# Altium project Underwater_Robot_Controller.PrjPcb (part 1 of 2)
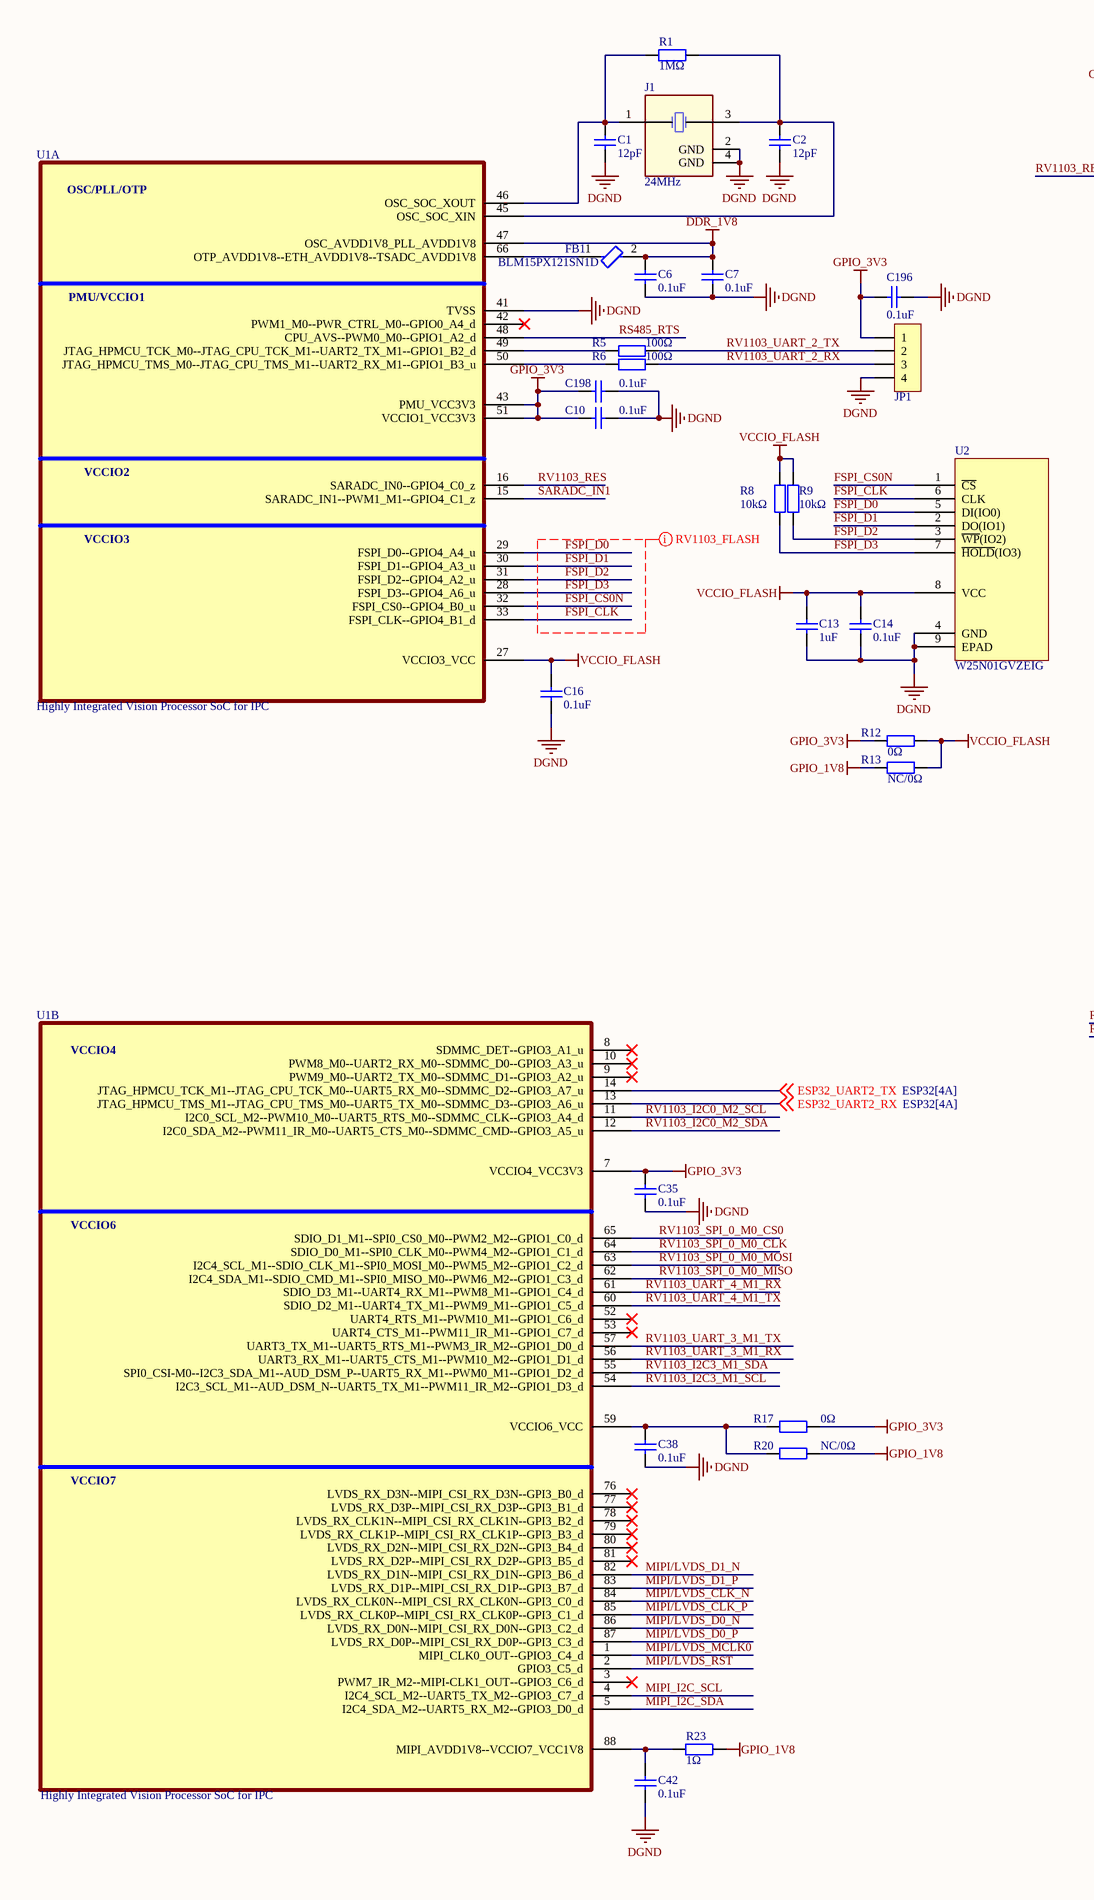
[diagram p0: RV1103.SchDoc, left]
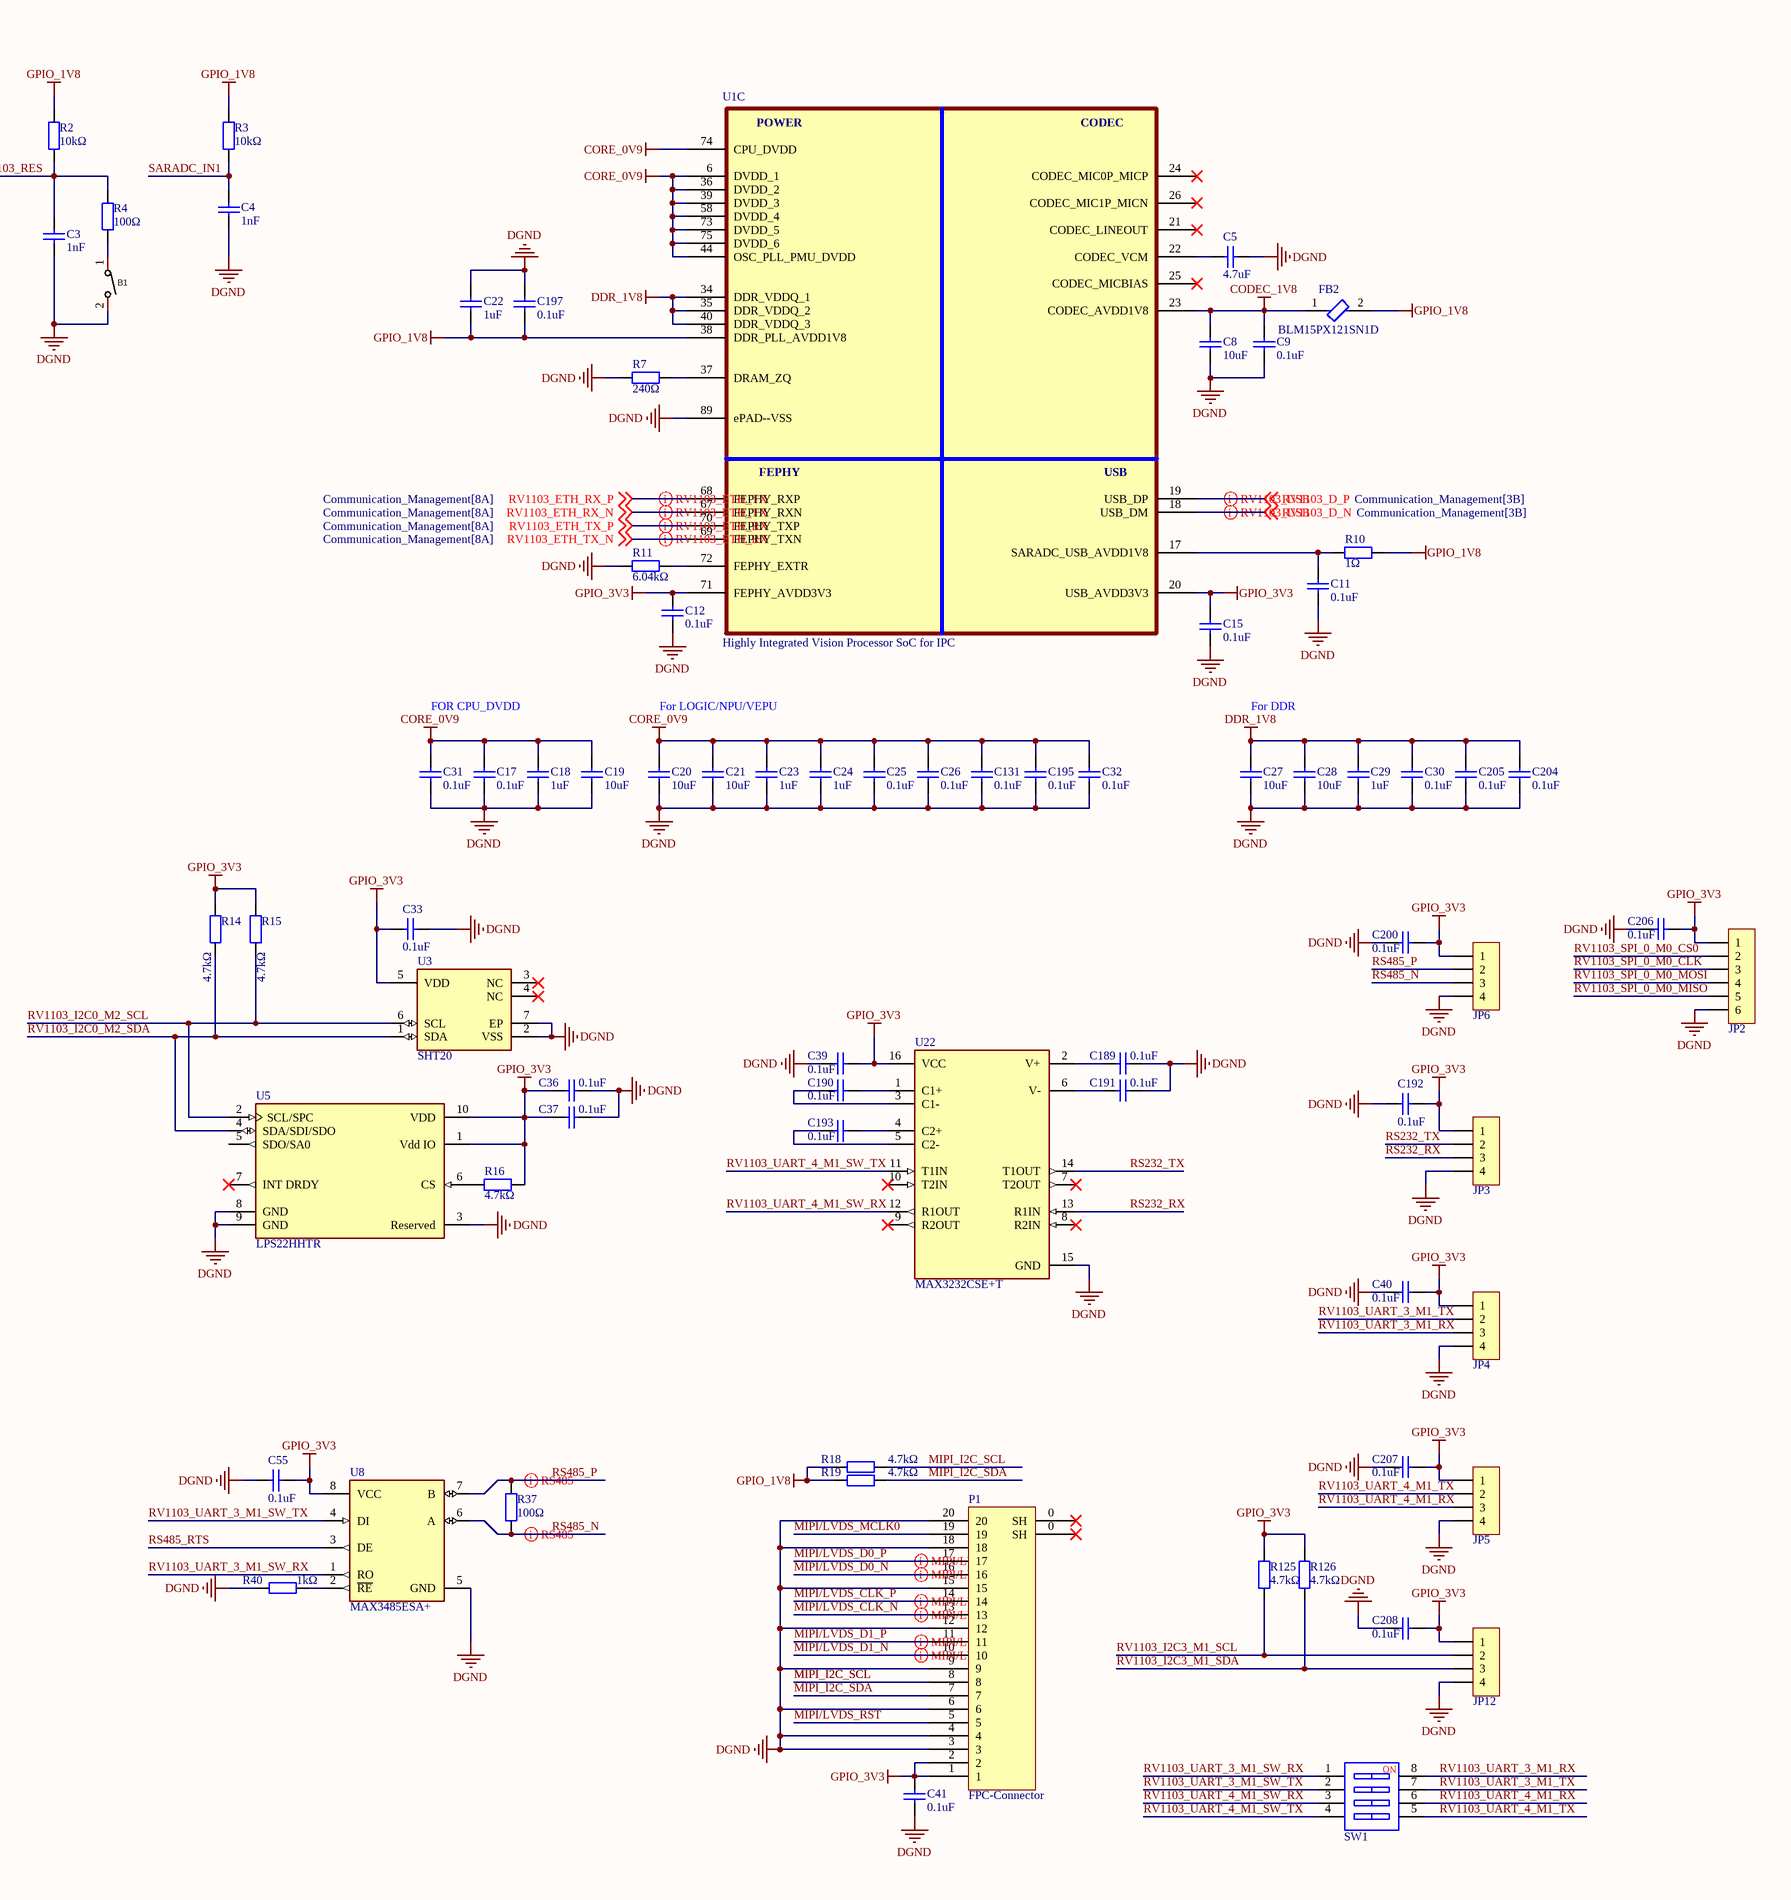
[diagram p1: RV1103.SchDoc, right]
4 sheets, 444 parts. Net scope: global (net labels, ports and power ports of the same name join across sheets).
Board file: URC.PcbDoc
Sheets:
  RV1103.SchDoc
  ESP32.SchDoc
  Power.SchDoc
  Communication_Management.SchDoc

## Sheet RV1103.SchDoc
size A2; Author: NZY(SFerret); SheetNumber: 1; SheetTotal: 4

### Parts
B1  Bottom-2P-1Way  [SW-SMD_L4.0-W2.9-LS5.0]  (value not drawn)
C1  12pF  [0402_C]
C2  12pF  [0402_C]
C3  1nF  [0402_C]
C4  1nF  [0402_C]
C5  4.7uF  [0402_C]
C6  0.1uF  [0402_C]
C7  0.1uF  [0402_C]
C8  10uF  [0402_C]
C9  0.1uF  [0402_C]
C10  0.1uF  [0402_C]
C11  0.1uF  [0402_C]
C12  0.1uF  [0402_C]
C13  1uF  [0603_C]
C14  0.1uF  [0603_C]
C15  0.1uF  [0402_C]
C16  0.1uF  [0402_C]
C17  0.1uF  [0402_C]
C18  1uF  [0402_C]
C19  10uF  [0603_C]
C20  10uF  [0603_C]
C21  10uF  [0603_C]
C22  1uF  [0402_C]
C23  1uF  [0402_C]
C24  1uF  [0402_C]
C25  0.1uF  [0402_C]
C26  0.1uF  [0402_C]
C27  10uF  [0603_C]
C28  10uF  [0603_C]
C29  1uF  [0402_C]
C30  0.1uF  [0402_C]
C31  0.1uF  [0402_C]
C32  0.1uF  [0402_C]
C33  0.1uF  [0603_C]
C35  0.1uF  [0402_C]
C36  0.1uF  [0603_C]
C37  0.1uF  [0603_C]
C38  0.1uF  [0402_C]
C39  0.1uF  [0603_C]
C40  0.1uF  [0603_C]
C41  0.1uF  [0603_C]
C42  0.1uF  [0402_C]
C55  0.1uF  [0603_C]
C131  0.1uF  [0402_C]
C189  0.1uF  [0603_C]
C190  0.1uF  [0603_C]
C191  0.1uF  [0603_C]
C192  0.1uF  [0603_C]
C193  0.1uF  [0603_C]
C195  0.1uF  [0402_C]
C196  0.1uF  [0603_C]
C197  0.1uF  [0402_C]
C198  0.1uF  [0402_C]
C200  0.1uF  [0603_C]
C204  0.1uF  [0402_C]
C205  0.1uF  [0402_C]
C206  0.1uF  [0603_C]
C207  0.1uF  [0603_C]
C208  0.1uF  [0603_C]
FB1  BLM15PX121SN1D  [FP-BLM15-0_05-d0_7-MFG]
FB2  BLM15PX121SN1D  [FP-BLM15-0_05-d0_7-MFG]
J1  24MHz  [SMD-2520_4P]
JP1  HDR-1X4  [MX 1.25-LS-4P]  (value not drawn)
JP2  HDR-1X6  [MX 1.25-LS-6P]  (value not drawn)
JP3  HDR-1X4  [MX 1.25-LS-4P]  (value not drawn)
JP4  HDR-1X4  [MX 1.25-LS-4P]  (value not drawn)
JP5  HDR-1X4  [MX 1.25-LS-4P]  (value not drawn)
JP6  HDR-1X4  [MX 1.25-LS-4P]  (value not drawn)
JP12  HDR-1X4  [MX 1.25-LS-4P]  (value not drawn)
P1  FPC-Connector  [FPC0.5 2H-WS-20P]
R1  1MΩ  [0402_R]
R2  10kΩ  [0402_R]
R3  10kΩ  [0402_R]
R4  100Ω  [0402_R]
R5  100Ω  [0402_R]
R6  100Ω  [0402_R]
R7  240Ω  [0402_R]
R8  10kΩ  [0603_R]
R9  10kΩ  [0603_R]
R10  1Ω  [0402_R]
R11  6.04kΩ  [0402_R]
R12  0Ω  [0402_R]
R13  NC/0Ω  [0402_R]
R14  4.7kΩ  [0603_R]
R15  4.7kΩ  [0603_R]
R16  4.7kΩ  [0603_R]
R17  0Ω  [0402_R]
R18  4.7kΩ  [0402_R]
R19  4.7kΩ  [0402_R]
R20  NC/0Ω  [0402_R]
R23  1Ω  [0402_R]
R37  100Ω  [0805_R]
R40  1kΩ  [0603_R]
R125  4.7kΩ  [0402_R]
R126  4.7kΩ  [0402_R]
SW1  SW-4P  [CSW1.27 SMD-4P]  (value not drawn)
U1  Highly Integrated Vision Processor SoC for IPC  [QFN35P900X900X95_HS-89N]  (parts A,B,C of 3)
U2  W25N01GVZEIG  [WSON-8_8X6_WIN]
U3  SHT20  [FP-SHT20-MFG]
U5  LPS22HHTR  [FP-HLGA-10L-DM00386636-MFG]
U8  MAX3485ESA+  [FP-S8-5-MFG]
U22  MAX3232CSE+T  [FP-S16-1-MFG]

### Nets
CODEC_1V8: C8.2 C9.2 FB2.1 U1.23(CODEC_AVDD1V8)
CORE_0V9: C17.2 C18.2 C19.2 C20.2 C21.2 C23.2 C24.2 C25.2 C26.2 C31.2 C32.2 C131.2 C195.2 U1.6(DVDD_1) U1.36(DVDD_2) U1.39(DVDD_3) U1.44(OSC_PLL_PMU_DVDD) U1.58(DVDD_4) U1.73(DVDD_5) U1.74(CPU_DVDD) U1.75(DVDD_6)
DDR_1V8: C6.1 C7.1 C27.2 C28.2 C29.2 C30.2 C204.2 C205.2 FB1.2 U1.34(DDR_VDDQ_1) U1.35(DDR_VDDQ_2) U1.40(DDR_VDDQ_3) U1.47(OSC_AVDD1V8_PLL_AVDD1V8)
DGND: B1.2 C1.1 C2.1 C3.1 C4.1 C5.2 C6.2 C7.2 C8.1 C9.1 C10.1 C11.1 C12.1 C13.1 C14.1 C15.1 C16.1 C17.1 C18.1 C19.1 C20.1 C21.1 C22.2 C23.1 C24.1 C25.1 C26.1 C27.1 C28.1 C29.1 C30.1 C31.1 C32.1 C33.2 C35.1 C36.2 C37.2 C38.1 C39.2 C40.2 C41.1 C42.1 C55.1 C131.1 C189.2 C191.2 C192.2 C195.1 C196.2 C197.2 C198.1 C200.1 C204.1 C205.1 C206.1 C207.2 C208.2 J1.2(GND) J1.4(GND) JP1.4 JP2.6 JP3.4 JP4.4 JP5.4 JP6.4 JP12.4 P1.3 P1.4 P1.6 P1.9 P1.12 P1.15 P1.18 P1.20 R7.1 R11.1 R40.2 U1.41(TVSS) U1.89(ePAD--VSS) U2.4(GND) U2.9(EPAD) U3.2(VSS) U3.7(EP) U5.3(Reserved) U5.8(GND) U5.9(GND) U8.5(GND) U22.15(GND)
GPIO_1V8: C22.1 C197.1 FB2.2 R2.2 R3.2 R10.2 R13.1 R18.2 R19.2 R20.2 R23.2 U1.38(DDR_PLL_AVDD1V8)
GPIO_3V3: C10.2 C12.2 C15.2 C33.1 C35.2 C36.1 C37.1 C39.1 C40.1 C41.2 C55.2 C192.1 C196.1 C198.2 C200.2 C206.2 C207.1 C208.1 JP1.1 JP2.1 JP3.1 JP4.1 JP5.1 JP6.1 JP12.1 P1.1 P1.2 R12.1 R14.2 R15.2 R16.1 R17.2 R125.2 R126.2 U1.7(VCCIO4_VCC3V3) U1.20(USB_AVDD3V3) U1.43(PMU_VCC3V3) U1.51(VCCIO1_VCC3V3) U1.71(FEPHY_AVDD3V3) U3.5(VDD) U5.1(Vdd_IO) U5.10(VDD) U8.8(VCC) U22.16(VCC)
VCCIO_FLASH: C13.2 C14.2 C16.2 R8.2 R9.2 R12.2 R13.2 U1.27(VCCIO3_VCC) U2.8(VCC)
ESP32_UART2_RX: U1.13(JTAG_HPMCU_TMS_M1--JTAG_CPU_TMS_M0--UART5_TX_M0--SDMMC_D3--GPIO3_A6_u) ; off-sheet ESP32_UART2_RX
ESP32_UART2_TX: U1.14(JTAG_HPMCU_TCK_M1--JTAG_CPU_TCK_M0--UART5_RX_M0--SDMMC_D2--GPIO3_A7_u) ; off-sheet ESP32_UART2_TX
FSPI_CLK: U1.33(FSPI_CLK--GPIO4_B1_d) U2.6(CLK)
FSPI_CS0N: U1.32(FSPI_CS0--GPIO4_B0_u) U2.1(~{CS})
FSPI_D0: U1.29(FSPI_D0--GPIO4_A4_u) U2.5(DI(IO0))
FSPI_D1: U1.30(FSPI_D1--GPIO4_A3_u) U2.2(DO(IO1))
FSPI_D2: R9.1 U1.31(FSPI_D2--GPIO4_A2_u) U2.3(~{WP}(IO2))
FSPI_D3: R8.1 U1.28(FSPI_D3--GPIO4_A6_u) U2.7(~{HOLD}(IO3))
MIPI/LVDS_CLK_N: P1.13 U1.84(LVDS_RX_CLK0N--MIPI_CSI_RX_CLK0N--GPI3_C0_d)
MIPI/LVDS_CLK_P: P1.14 U1.85(LVDS_RX_CLK0P--MIPI_CSI_RX_CLK0P--GPI3_C1_d)
MIPI/LVDS_D0_N: P1.16 U1.86(LVDS_RX_D0N--MIPI_CSI_RX_D0N--GPI3_C2_d)
MIPI/LVDS_D0_P: P1.17 U1.87(LVDS_RX_D0P--MIPI_CSI_RX_D0P--GPI3_C3_d)
MIPI/LVDS_D1_N: P1.10 U1.82(LVDS_RX_D1N--MIPI_CSI_RX_D1N--GPI3_B6_d)
MIPI/LVDS_D1_P: P1.11 U1.83(LVDS_RX_D1P--MIPI_CSI_RX_D1P--GPI3_B7_d)
MIPI/LVDS_MCLK0: P1.19 U1.1(MIPI_CLK0_OUT--GPIO3_C4_d)
MIPI/LVDS_RST: P1.5 U1.2(GPIO3_C5_d)
MIPI_I2C_SCL: P1.8 R18.1 U1.4(I2C4_SCL_M2--UART5_TX_M2--GPIO3_C7_d)
MIPI_I2C_SDA: P1.7 R19.1 U1.5(I2C4_SDA_M2--UART5_RX_M2--GPIO3_D0_d)
RS232_RX: JP3.3 U22.13(R1IN)
RS232_TX: JP3.2 U22.14(T1OUT)
RS485_N: JP6.3 R37.1 U8.6(A)
RS485_P: JP6.2 R37.2 U8.7(B)
RS485_RTS: U1.48(CPU_AVS--PWM0_M0--GPIO1_A2_d) U8.3(DE)
RV1103_D_N: U1.18(USB_DM) ; off-sheet RV1103_D_N
RV1103_D_P: U1.19(USB_DP) ; off-sheet RV1103_D_P
RV1103_ETH_RX_N: U1.67(FEPHY_RXN) ; off-sheet RV1103_ETH_RX_N
RV1103_ETH_RX_P: U1.68(FEPHY_RXP) ; off-sheet RV1103_ETH_RX_P
RV1103_ETH_TX_N: U1.69(FEPHY_TXN) ; off-sheet RV1103_ETH_TX_N
RV1103_ETH_TX_P: U1.70(FEPHY_TXP) ; off-sheet RV1103_ETH_TX_P
RV1103_I2C0_M2_SCL: R15.1 U1.11(I2C0_SCL_M2--PWM10_M0--UART5_RTS_M0--SDMMC_CLK--GPIO3_A4_d) U3.6(SCL) U5.2(SCL/SPC)
RV1103_I2C0_M2_SDA: R14.1 U1.12(I2C0_SDA_M2--PWM11_IR_M0--UART5_CTS_M0--SDMMC_CMD--GPIO3_A5_u) U3.1(SDA) U5.4(SDA/SDI/SDO)
RV1103_I2C3_M1_SCL: JP12.2 R125.1 U1.54(I2C3_SCL_M1--AUD_DSM_N--UART5_TX_M1--PWM11_IR_M2--GPIO1_D3_d)
RV1103_I2C3_M1_SDA: JP12.3 R126.1 U1.55(SPI0_CSI-M0--I2C3_SDA_M1--AUD_DSM_P--UART5_RX_M1--PWM0_M1--GPIO1_D2_d)
RV1103_RES: C3.2 R2.1 R4.2 U1.16(SARADC_IN0--GPIO4_C0_z)
RV1103_SPI_0_M0_CLK: JP2.3 U1.64(SDIO_D0_M1--SPI0_CLK_M0--PWM4_M2--GPIO1_C1_d)
RV1103_SPI_0_M0_CS0: JP2.2 U1.65(SDIO_D1_M1--SPI0_CS0_M0--PWM2_M2--GPIO1_C0_d)
RV1103_SPI_0_M0_MISO: JP2.5 U1.62(I2C4_SDA_M1--SDIO_CMD_M1--SPI0_MISO_M0--PWM6_M2--GPIO1_C3_d)
RV1103_SPI_0_M0_MOSI: JP2.4 U1.63(I2C4_SCL_M1--SDIO_CLK_M1--SPI0_MOSI_M0--PWM5_M2--GPIO1_C2_d)
RV1103_UART_2_RX: JP1.3 R6.2
RV1103_UART_2_TX: JP1.2 R5.2
RV1103_UART_3_M1_RX: JP4.3 SW1.8 U1.56(UART3_RX_M1--UART5_CTS_M1--PWM10_M2--GPIO1_D1_d)
RV1103_UART_3_M1_SW_RX: SW1.1 U8.1(RO)
RV1103_UART_3_M1_SW_TX: SW1.2 U8.4(DI)
RV1103_UART_3_M1_TX: JP4.2 SW1.7 U1.57(UART3_TX_M1--UART5_RTS_M1--PWM3_IR_M2--GPIO1_D0_d)
RV1103_UART_4_M1_RX: JP5.3 SW1.6 U1.61(SDIO_D3_M1--UART4_RX_M1--PWM8_M1--GPIO1_C4_d)
RV1103_UART_4_M1_SW_RX: SW1.3 U22.12(R1OUT)
RV1103_UART_4_M1_SW_TX: SW1.4 U22.11(T1IN)
RV1103_UART_4_M1_TX: JP5.2 SW1.5 U1.60(SDIO_D2_M1--UART4_TX_M1--PWM9_M1--GPIO1_C5_d)
SARADC_IN1: C4.2 R3.1 U1.15(SARADC_IN1--PWM1_M1--GPIO4_C1_z)
NetB1_1: B1.1 R4.1
NetC1_2: C1.2 J1.1(OSC1) R1.1 U1.46(OSC_SOC_XOUT)
NetC2_2: C2.2 J1.3(OSC2) R1.2 U1.45(OSC_SOC_XIN)
NetC5_1: C5.1 U1.22(CODEC_VCM)
NetC11_2: C11.2 R10.1 U1.17(SARADC_USB_AVDD1V8)
NetC38_2: C38.2 R17.1 R20.1 U1.59(VCCIO6_VCC)
NetC42_2: C42.2 R23.1 U1.88(MIPI_AVDD1V8--VCCIO7_VCC1V8)
NetC189_1: C189.1 U22.2(V+)
NetC190_1: C190.1 U22.3(C1-)
NetC190_2: C190.2 U22.1(C1+)
NetC191_1: C191.1 U22.6(V-)
NetC193_1: C193.1 U22.5(C2-)
NetC193_2: C193.2 U22.4(C2+)
NetFB1_1: FB1.1 U1.66(OTP_AVDD1V8--ETH_AVDD1V8--TSADC_AVDD1V8)
NetR5_1: R5.1 U1.49(JTAG_HPMCU_TCK_M0--JTAG_CPU_TCK_M1--UART2_TX_M1--GPIO1_B2_d)
NetR6_1: R6.1 U1.50(JTAG_HPMCU_TMS_M0--JTAG_CPU_TMS_M1--UART2_RX_M1--GPIO1_B3_u)
NetR7_2: R7.2 U1.37(DRAM_ZQ)
NetR11_2: R11.2 U1.72(FEPHY_EXTR)
NetR16_2: R16.2 U5.6(CS)
NetR40_1: R40.1 U8.2(~{RE})

Not connected (* = marked no-connect by the designer): P1 0(SH)*; U1 3(PWM7_IR_M2--MIPI-CLK1_OUT--GPIO3_C6_d)* 8(SDMMC_DET--GPIO3_A1_u)* 9(PWM9_M0--UART2_TX_M0--SDMMC_D1--GPIO3_A2_u)* 10(PWM8_M0--UART2_RX_M0--SDMMC_D0--GPIO3_A3_u)* 21(CODEC_LINEOUT)* 24(CODEC_MIC0P_MICP)* 25(CODEC_MICBIAS)* 26(CODEC_MIC1P_MICN)* 42(PWM1_M0--PWR_CTRL_M0--GPIO0_A4_d)* 52(UART4_RTS_M1--PWM10_M1--GPIO1_C6_d)* 53(UART4_CTS_M1--PWM11_IR_M1--GPIO1_C7_d)* 76(LVDS_RX_D3N--MIPI_CSI_RX_D3N--GPI3_B0_d)* 77(LVDS_RX_D3P--MIPI_CSI_RX_D3P--GPI3_B1_d)* 78(LVDS_RX_CLK1N--MIPI_CSI_RX_CLK1N--GPI3_B2_d)* 79(LVDS_RX_CLK1P--MIPI_CSI_RX_CLK1P--GPI3_B3_d)* 80(LVDS_RX_D2N--MIPI_CSI_RX_D2N--GPI3_B4_d)* 81(LVDS_RX_D2P--MIPI_CSI_RX_D2P--GPI3_B5_d)*; U3 3(NC)* 4(NC)*; U5 5(SDO/SA0) 7(INT_DRDY)*; U22 7(T2OUT)* 8(R2IN)* 9(R2OUT)* 10(T2IN)*

### Layout directives
differential pair: MIPI/LVDS_CLK_N, MIPI/LVDS_CLK_P, MIPI/LVDS_D0_N, MIPI/LVDS_D0_P, MIPI/LVDS_D1_N, MIPI/LVDS_D1_P, RS485_N, RS485_P, RV1103_D_N, RV1103_D_P, RV1103_ETH_RX_N, RV1103_ETH_RX_P, RV1103_ETH_TX_N, RV1103_ETH_TX_P
net class RV1103_FLASH: FSPI_CLK, FSPI_CS0N, FSPI_D0, FSPI_D1, FSPI_D2, FSPI_D3

### Notes on the sheet
- FOR CPU_DVDD
- For LOGIC/NPU/VEPU
- For DDR
- (in symbol RV1103G, part A) OSC/PLL/OTP; PMU/VCCIO1; VCCIO2; VCCIO3
- (in symbol RV1103G, part B) VCCIO4; VCCIO6; VCCIO7
- (in symbol RV1103G, part C) POWER; CODEC; FEPHY; USB
- (in symbol SW-4P) NO

### Library data of the parts
B1 = Bottom-2P-1Way: 轻触按键; Manufacturer: SHOU HAN(首韩); Symbol: TS342A2P-WZ; Add into BOM: yes; Device: TS342A2P-WZ; LCSC Part Name: 轻触开关 3*4*2 两脚小龟不带柱 250gf 黑色塑胶按钮; Supplier Part: C557591; Manufacturer Part: TS342A2P-WZ; Supplier Footprint: SMD; JLCPCB Part Class: Extended Part; Datasheet: https://atta.szlcsc.com/upload/public/pdf/source/20200519/C557591_B3A5A21584733303F06306F18577DA8B.pdf; Supplier: LCSC; Convert to PCB: yes
C1-C33 C35-C42 C55 C131 C189-C193 C195-C198 C200 C204-C208 = SMT_Cap: 贴片电容; ComponentLink1Description: 供应商链接; ComponentLink1URL: http://www.szlcsc.com/product/details_29010.html; Package: 0805; Supplier: LC; SuppliersPartNumber: C28260
FB1 FB2 = CMP-0686-00133-3: Chip Ferrite Bead, 0402, 120Ω @ 100MHz, 0.055Ω, 25%, 2A; Impedance: 120R; DC Resistance (DCR): 55mR; Number of Circuits: 1; Material: Steel; Lead Free: Lead Free; Package Quantity: 10000; Width: 0.5mm; Case Code (Metric): 1005; Test Frequency: 100MHz; Weight: 2.3E-05oz; Max DC Current: 2A; Current Rating: 2A; REACH SVHC: No SVHC; Case Code (Imperial): 0402; Min Operating Temperature: -55°C; Max Operating Temperature: 125°C; Max Current Rating: 2A; Series: EMIFIL®, BLM15P; Tolerance: 25%; Termination: SMD/SMT; Number of Lines: 1; Case/Package: 0402; RoHS Compliant: Yes; Number of Pins: 2; Length: 1mm; Height: 0.5mm; Packaging: Tape and Reel
J1 = Oscillator_SMT_4P
JP1 JP3-JP6 JP12 = Header 4: 4P接插件; 卖家免费技术支持，联系售后: 唯一出售店铺网址https://shop463601444.taobao.com; 封装库来自淘宝卖家 ID：黄晶宝石: 其他店铺购入均为假冒，请申请退款，本店现金奖励; 优秀评价可免费更新封装库: 联系淘宝ID：黄晶宝石，获取更新版封装库; BOM名称: 4P接插件
JP2 = Header 6: 6P接插件; 卖家免费技术支持，联系售后: 唯一出售店铺网址https://shop463601444.taobao.com; 封装库来自淘宝卖家 ID：黄晶宝石: 其他店铺购入均为假冒，请申请退款，本店现金奖励; 优秀评价可免费更新封装库: 联系淘宝ID：黄晶宝石，获取更新版封装库; BOM名称: 6P接插件
P1 = FFC/FPC-0.5-WS-20
R1-R20 R23 R37 R40 R125 R126 = SMT_Res: 贴片电阻; ComponentLink1Description: 供应商链接; ComponentLink1URL: http://www.szlcsc.com/product/details_23980.html; Package: 0603; Supplier: LC; SuppliersPartNumber: C23253
SW1 = SW-4P: 4路编码开关; 免费技术支持，联系售后: 唯一出售店铺网址https://shop463601444.taobao.com; 封装库来自淘宝卖家 ID：黄晶宝石: 其他店铺购入均为盗版假冒封装库，请立即申请退款，本店3~10元现金奖励; BOM名称: 4路编码开关
U1 = RV1103G: RV1103 is a highly integrated vision processor SoC for IPC, especially for AI related / applications.
U2 = W25N01GVZEIG: 1G-BIT SPI FLASH
U3 = CMP-2000-05344-2: SENSOR HUMID/TEMP 3V I2C 3% SMD; Manufacturer: Sensirion; Min Supply Voltage: 2.1V; Automotive Grade: Grade 1; Max Supply Voltage: 3.6V; Operating Supply Current: 300uA; Resolution: 14bits; Device Class L2: Temperature and Humidity Sensors; Ipc Land Pattern Name: DFN300X300X110-6; Category: IC; Device Class L3: unset; Accuracy: 3%; ComponentLink2URL: https://www.sensirion.com/fileadmin/user_upload/customers/sensirion/Dokumente/0_Datasheets/Humidity/Sensirion_Humidity_Sensors_SHT20_Datasheet.pdf; Temperature: -40°C to +125°C; Interface: I2C; Lead Free: Yes; Temperature Range High: +125°C; Automotive: Yes; Device Class L1: Sensors; Height: 1.1mm; Temperature Range Low: -40°C; ComponentLink2Description: Datasheet; Octopart: https://octopart.com/sht20-sensirion-47077745; Sensor Output: I2C; Manufacturer Part Number: SHT20; Package: 0; Digikey Description: SENSOR HUMID/TEMP 3V I2C 3% SMD; RoHS: TRUE
U5 = CMP-12182-000001-1: CONSUMER MEMS; Manufacturer: STMicroelectronics; Operating Supply Current: 4-12uA; Sensor Output: I2C,SPI; Port Style: No Port; Min Supply Voltage: 1.7V; Max Supply Voltage: 3.7V; Package: HLGA-10L-DM00386636; Temperature Range Low: -40°C; RoHS: TRUE; Device Class L1: Sensors; Automotive: No; Manufacturer Part Number: LPS22HHTR; ComponentLink2URL: https://www.st.com/resource/en/datasheet/lps22hh.pdf; Temperature: -40°C to +85°C; Category: IC; Device Class L3: unset; ComponentLink2Description: Datasheet; Lead Free: Yes; Temperature Range High: +85°C; Octopart: https://octopart.com/lps22hhtr-stmicroelectronics-94834025; Footprint Url: https://www.st.com/content/ccc/resource/technical/document/technical_note/73/17/9c/16/dd/96/4a/01/CD00134799.pdf/files/CD00134799.pdf/jcr:content/translations/en.CD00134799.pdf; Height: 0.8mm; Device Class L2: Pressure Sensors; Digikey Description: CONSUMER MEMS
U8 = CMP-05679-000020-1: IC TXRX RS485/422 10MBPS 8SOIC; Manufacturer: Maxim Integrated; Nominal Supply Current: 0.95-1.1mA; Data Rate: 10Mbits/s; Min Supply Voltage: 3V; Interface: RS-485,RS-422; Number Of Transmitters: 1; Max Supply Voltage: 3.6V; Max Junction Temp: +160°C; Standoff Height: 0.1mm; Simplex Duplex: Half Duplex; Height: 1.75mm; Temperature Range High: +85°C; Device Class L2: Interface ICs; Digikey Description: IC TXRX RS485/422 10MBPS 8SOIC; Temperature: -40°C to +85°C; Device Class L3: RS-232 / RS-422 / RS-485 Interface ICs; Temperature Range Low: -40°C; Footprint Url: https://pdfserv.maximintegrated.com/land_patterns/90-0096.PDF; Category: IC; ComponentLink2URL: https://datasheets.maximintegrated.com/en/ds/MAX3483-MAX3491.pdf; Package: S8-5; Octopart: https://octopart.com/max3485esa%2B-maxim+integrated-39731860; RoHS: TRUE; Manufacturer Part Number: MAX3485ESA+; Lead Free: Yes; ComponentLink2Description: Datasheet; Device Class L1: Integrated Circuits (ICs); Mouser Description: 3.3V Powered, 10Mbps and Slew-Rate Limited, True RS-485/RS-422 Transceivers; Number Of Receivers: 1; Automotive: No
U22 = CMP-2000-06662-2: IC TXRX RS-232 LP 16SOIC; Manufacturer: Maxim Integrated; Nominal Supply Current: 0.3mA; Max Supply Voltage: 5.5V; Number Of Transmitters: 2; Simplex Duplex: Full Duplex; Min Supply Voltage: 3V; Data Rate: 235kbits/s; Standoff Height: 0.1mm; ComponentLink2URL: https://www.maximintegrated.com/en/ds/MAX3222-MAX3241.pdf; Device Class L2: Interface ICs; Interface: RS-232; RoHS: TRUE; Octopart: https://octopart.com/max3232cse%2Bt-maxim+integrated-39731899; Category: IC; Device Class L3: RS-232 / RS-422 / RS-485 Interface ICs; Automotive: No; Mouser Description: RS-232 Interface IC 3-5.5V 235kbps Transceiver; Temperature Range High: +70°C; Manufacturer Part Number: MAX3232CSE+T; Number Of Receivers: 2; Digikey Description: IC TXRX RS-232 LP 16SOIC; ComponentLink2Description: Datasheet; Temperature Range Low: 0°C; Footprint Url: https://pdfserv.maximintegrated.com/land_patterns/90-0097.PDF; Device Class L1: Integrated Circuits (ICs); Ipc Land Pattern Name: SOIC127P600X155-16; Lead Free: Yes; Package: S16-1; Height: 1.75mm; Temperature: 0°C to +70°C

## Sheet ESP32.SchDoc
size A2; SheetNumber: 2; SheetTotal: 4
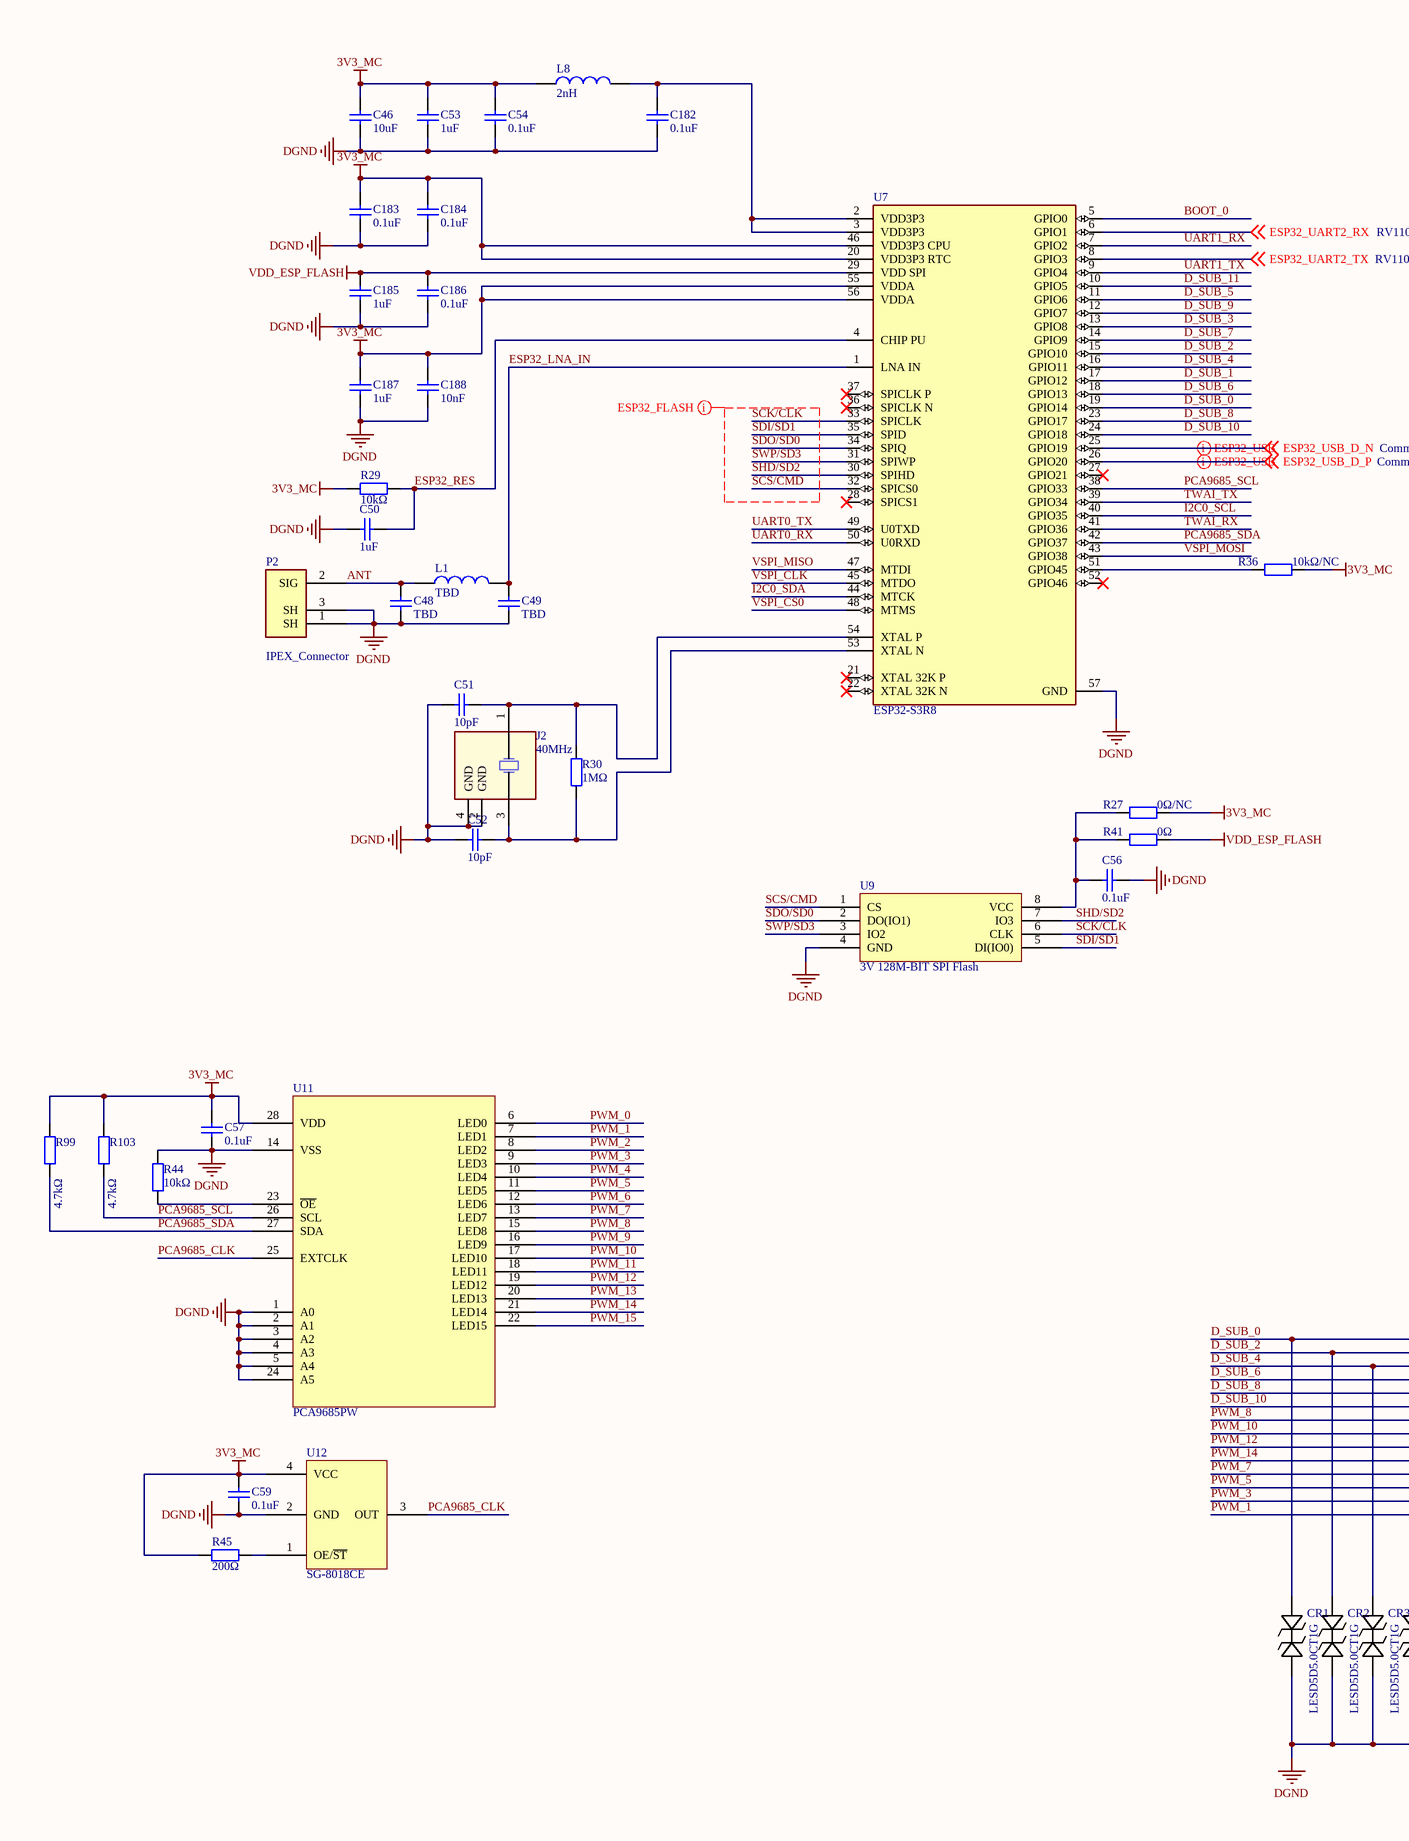
[diagram p2: ESP32.SchDoc, left]
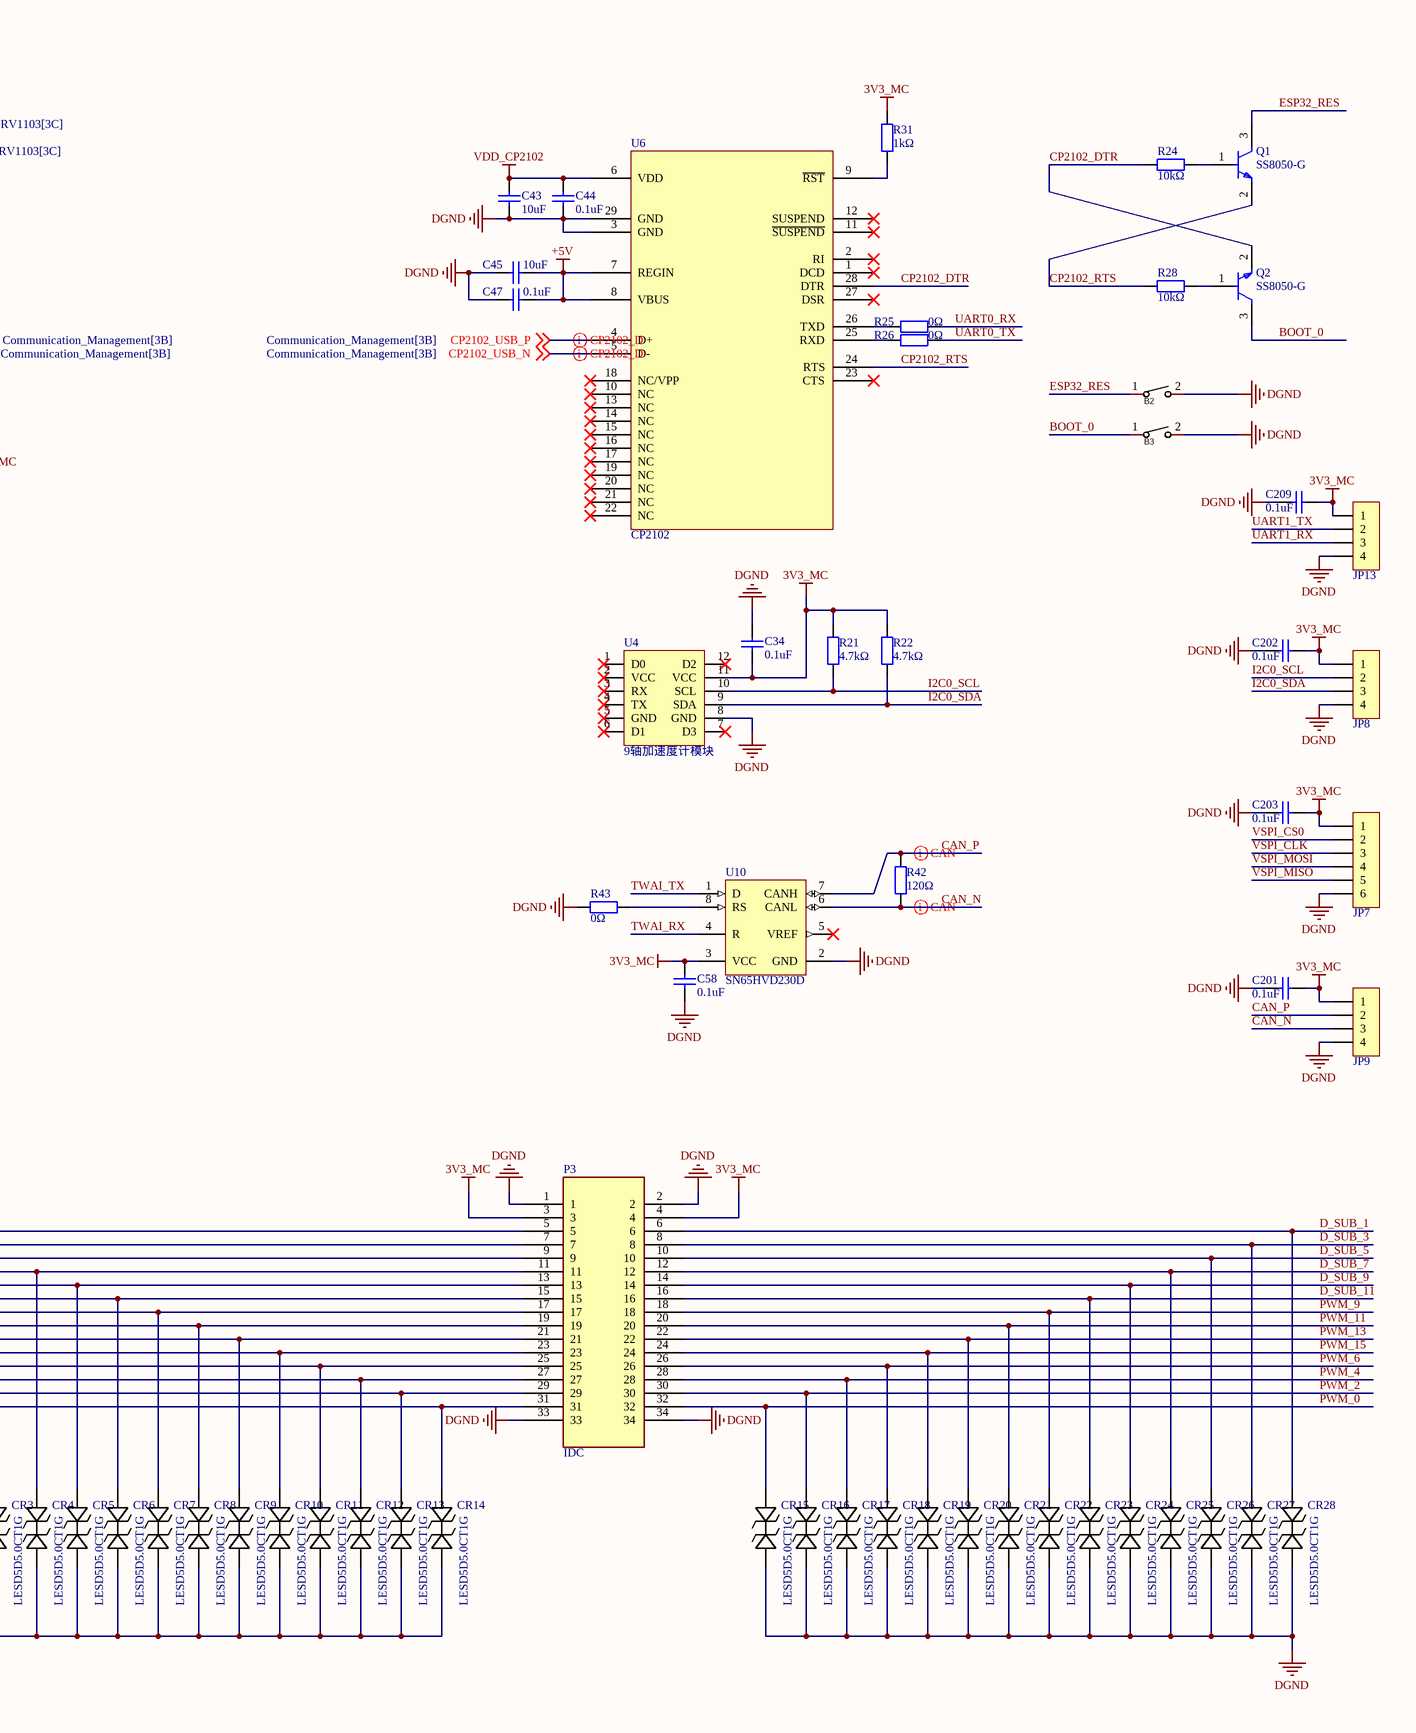
[diagram p3: ESP32.SchDoc, right]

### Parts
B2  Bottom-2P-1Way  [SW-SMD_L4.0-W2.9-LS5.0]  (value not drawn)
B3  Bottom-2P-1Way  [SW-SMD_L4.0-W2.9-LS5.0]  (value not drawn)
C34  0.1uF  [0603_C]
C43  10uF  [0603_C]
C44  0.1uF  [0603_C]
C45  10uF  [0603_C]
C46  10uF  [0603_C]
C47  0.1uF  [0603_C]
C48  TBD  [0402_C]
C49  TBD  [0402_C]
C50  1uF  [0402_C]
C51  10pF  [0402_C]
C52  10pF  [0402_C]
C53  1uF  [0603_C]
C54  0.1uF  [0402_C]
C56  0.1uF  [0603_C]
C57  0.1uF  [0603_C]
C58  0.1uF  [0603_C]
C59  0.1uF  [0603_C]
C182  0.1uF  [0402_C]
C183  0.1uF  [0402_C]
C184  0.1uF  [0402_C]
C185  1uF  [0402_C]
C186  0.1uF  [0402_C]
C187  1uF  [0402_C]
C188  10nF  [0402_C]
C201  0.1uF  [0603_C]
C202  0.1uF  [0603_C]
C203  0.1uF  [0603_C]
C209  0.1uF  [0603_C]
CR1  LESD5D5.0CT1G  [CR_5.0CT1G_UMW]
CR2  LESD5D5.0CT1G  [CR_5.0CT1G_UMW]
CR3  LESD5D5.0CT1G  [CR_5.0CT1G_UMW]
CR4  LESD5D5.0CT1G  [CR_5.0CT1G_UMW]
CR5  LESD5D5.0CT1G  [CR_5.0CT1G_UMW]
CR6  LESD5D5.0CT1G  [CR_5.0CT1G_UMW]
CR7  LESD5D5.0CT1G  [CR_5.0CT1G_UMW]
CR8  LESD5D5.0CT1G  [CR_5.0CT1G_UMW]
CR9  LESD5D5.0CT1G  [CR_5.0CT1G_UMW]
CR10  LESD5D5.0CT1G  [CR_5.0CT1G_UMW]
CR11  LESD5D5.0CT1G  [CR_5.0CT1G_UMW]
CR12  LESD5D5.0CT1G  [CR_5.0CT1G_UMW]
CR13  LESD5D5.0CT1G  [CR_5.0CT1G_UMW]
CR14  LESD5D5.0CT1G  [CR_5.0CT1G_UMW]
CR15  LESD5D5.0CT1G  [CR_5.0CT1G_UMW]
CR16  LESD5D5.0CT1G  [CR_5.0CT1G_UMW]
CR17  LESD5D5.0CT1G  [CR_5.0CT1G_UMW]
CR18  LESD5D5.0CT1G  [CR_5.0CT1G_UMW]
CR19  LESD5D5.0CT1G  [CR_5.0CT1G_UMW]
CR20  LESD5D5.0CT1G  [CR_5.0CT1G_UMW]
CR21  LESD5D5.0CT1G  [CR_5.0CT1G_UMW]
CR22  LESD5D5.0CT1G  [CR_5.0CT1G_UMW]
CR23  LESD5D5.0CT1G  [CR_5.0CT1G_UMW]
CR24  LESD5D5.0CT1G  [CR_5.0CT1G_UMW]
CR25  LESD5D5.0CT1G  [CR_5.0CT1G_UMW]
CR26  LESD5D5.0CT1G  [CR_5.0CT1G_UMW]
CR27  LESD5D5.0CT1G  [CR_5.0CT1G_UMW]
CR28  LESD5D5.0CT1G  [CR_5.0CT1G_UMW]
J2  40MHz  [SMD-2520_4P]
JP7  HDR-1X6  [MX 1.25-LS-6P]  (value not drawn)
JP8  HDR-1X4  [MX 1.25-LS-4P]  (value not drawn)
JP9  HDR-1X4  [MX 1.25-LS-4P]  (value not drawn)
JP13  HDR-1X4  [MX 1.25-LS-4P]  (value not drawn)
L1  TBD  [0402_L]
L8  2nH  [0402_L]
P2  IPEX_Connector  [IPEX]
P3  IDC  [IDC2.54-LI-2x17P]
Q1  SS8050-G  [FP-SS8050-G-MFG]
Q2  SS8050-G  [FP-SS8050-G-MFG]
R21  4.7kΩ  [0603_R]
R22  4.7kΩ  [0603_R]
R24  10kΩ  [0603_R]
R25  0Ω  [0603_R]
R26  0Ω  [0603_R]
R27  0Ω/NC  [0402_R]
R28  10kΩ  [0603_R]
R29  10kΩ  [0402_R]
R30  1MΩ  [0402_R]
R31  1kΩ  [0603_R]
R36  10kΩ/NC  [0402_R]
R41  0Ω  [0402_R]
R42  120Ω  [0805_R]
R43  0Ω  [0603_R]
R44  10kΩ  [0603_R]
R45  200Ω  [0603_R]
R99  4.7kΩ  [0603_R]
R103  4.7kΩ  [0603_R]
U4  9轴加速度计模块  [9轴加速度计]
U6  CP2102  [QFN50P500X500X100_HS-29N]
U7  ESP32-S3R8  [QFN40P700X700X90_HS-57M]
U9  3V 128M-BIT SPI Flash  [SOIC-8-Body 5.28x5.28mm]
U10  SN65HVD230D  [D0008A_M]
U11  PCA9685PW  [SOP65P640X110-28N]
U12  SG-8018CE  [OSC-2520-4P]

### Nets
3V3_MC: C34.1 C46.2 C53.2 C54.2 C57.2 C58.2 C59.2 C183.2 C184.2 C187.2 C188.2 C201.2 C202.2 C203.2 C209.2 JP7.1 JP8.1 JP9.1 JP13.1 L8.1 P3.3 P3.4 R21.2 R22.2 R27.2 R29.1 R31.2 R36.2 R45.2 R99.1 R103.1 U4.11(VCC) U7.20(VDD3P3_RTC) U7.46(VDD3P3_CPU) U7.55(VDDA) U7.56(VDDA) U10.3(VCC) U11.28(VDD) U12.4(VCC)
+5V: C45.1 C47.1 U6.7(REGIN) U6.8(VBUS)
DGND: B2.2 B3.2 C34.2 C43.2 C44.2 C45.2 C46.1 C47.2 C48.1 C49.1 C50.1 C51.1 C52.1 C53.1 C54.1 C56.2 C57.1 C58.1 C59.1 C182.1 C183.1 C184.1 C185.1 C186.1 C187.1 C188.1 C201.1 C202.1 C203.1 C209.1 CR1.2 CR2.2 CR3.2 CR4.2 CR5.2 CR6.2 CR7.2 CR8.2 CR9.2 CR10.2 CR11.2 CR12.2 CR13.2 CR14.2 CR15.2 CR16.2 CR17.2 CR18.2 CR19.2 CR20.2 CR21.2 CR22.2 CR23.2 CR24.2 CR25.2 CR26.2 CR27.2 CR28.2 J2.2(GND) J2.4(GND) JP7.6 JP8.4 JP9.4 JP13.4 P2.1(SH) P2.3(SH) P3.1 P3.2 P3.33 P3.34 R43.1 R44.2 U4.8(GND) U6.3(GND) U6.29(GND) U7.57(GND) U9.4(GND) U10.2(GND) U11.1(A0) U11.2(A1) U11.3(A2) U11.4(A3) U11.5(A4) U11.14(VSS) U11.24(A5) U12.2(GND)
VDD_CP2102: C43.1 C44.1 U6.6(VDD)
VDD_ESP_FLASH: C185.2 C186.2 R41.2 U7.29(VDD_SPI)
ANT: C48.2 L1.1 P2.2(SIG)
BOOT_0: B3.1 Q2.3(C) U7.5(GPIO0)
CAN_N: JP9.3 R42.1 U10.6(CANL)
CAN_P: JP9.2 R42.2 U10.7(CANH)
CP2102_DTR: Q2.2(E) R24.1 U6.28(DTR)
CP2102_RTS: Q1.2(E) R28.1 U6.24(RTS)
CP2102_USB_N: U6.5(D-) ; off-sheet CP2102_USB_N
CP2102_USB_P: U6.4(D+) ; off-sheet CP2102_USB_P
D_SUB_0: CR1.1 P3.5 U7.19(GPIO14)
D_SUB_1: CR28.1 P3.6 U7.17(GPIO12)
D_SUB_2: CR2.1 P3.7 U7.15(GPIO10)
D_SUB_3: CR27.1 P3.8 U7.13(GPIO8)
D_SUB_4: CR3.1 P3.9 U7.16(GPIO11)
D_SUB_5: CR26.1 P3.10 U7.11(GPIO6)
D_SUB_6: CR4.1 P3.11 U7.18(GPIO13)
D_SUB_7: CR25.1 P3.12 U7.14(GPIO9)
D_SUB_8: CR5.1 P3.13 U7.23(GPIO17)
D_SUB_9: CR24.1 P3.14 U7.12(GPIO7)
D_SUB_10: CR6.1 P3.15 U7.24(GPIO18)
D_SUB_11: CR23.1 P3.16 U7.10(GPIO5)
ESP32_LNA_IN: C49.2 L1.2 U7.1(LNA_IN)
ESP32_RES: B2.1 C50.2 Q1.3(C) R29.2 U7.4(CHIP_PU)
ESP32_UART2_RX: U7.6(GPIO1) ; off-sheet ESP32_UART2_RX
ESP32_UART2_TX: U7.8(GPIO3) ; off-sheet ESP32_UART2_TX
ESP32_USB_D_N: U7.25(GPIO19) ; off-sheet ESP32_USB_D_N
ESP32_USB_D_P: U7.26(GPIO20) ; off-sheet ESP32_USB_D_P
I2C0_SCL: JP8.2 R21.1 U4.10(SCL) U7.40(GPIO35)
I2C0_SDA: JP8.3 R22.1 U4.9(SDA) U7.44(MTCK)
PCA9685_CLK: U11.25(EXTCLK) U12.3(OUT)
PCA9685_SCL: R103.2 U7.38(GPIO33) U11.26(SCL)
PCA9685_SDA: R99.2 U7.42(GPIO37) U11.27(SDA)
PWM_0: CR15.1 P3.32 U11.6(LED0)
PWM_1: CR14.1 P3.31 U11.7(LED1)
PWM_2: CR16.1 P3.30 U11.8(LED2)
PWM_3: CR13.1 P3.29 U11.9(LED3)
PWM_4: CR17.1 P3.28 U11.10(LED4)
PWM_5: CR12.1 P3.27 U11.11(LED5)
PWM_6: CR18.1 P3.26 U11.12(LED6)
PWM_7: CR11.1 P3.25 U11.13(LED7)
PWM_8: CR7.1 P3.17 U11.15(LED8)
PWM_9: CR22.1 P3.18 U11.16(LED9)
PWM_10: CR8.1 P3.19 U11.17(LED10)
PWM_11: CR21.1 P3.20 U11.18(LED11)
PWM_12: CR9.1 P3.21 U11.19(LED12)
PWM_13: CR20.1 P3.22 U11.20(LED13)
PWM_14: CR10.1 P3.23 U11.21(LED14)
PWM_15: CR19.1 P3.24 U11.22(LED15)
SCK/CLK: U7.33(SPICLK) U9.6(CLK)
SCS/CMD: U7.32(SPICS0) U9.1(CS)
SDI/SD1: U7.35(SPID) U9.5(DI(IO0))
SDO/SD0: U7.34(SPIQ) U9.2(DO(IO1))
SHD/SD2: U7.30(SPIHD) U9.7(IO3)
SWP/SD3: U7.31(SPIWP) U9.3(IO2)
TWAI_RX: U7.41(GPIO36) U10.4(R)
TWAI_TX: U7.39(GPIO34) U10.1(D)
UART0_RX: R25.2 U7.50(U0RXD)
UART0_TX: R26.2 U7.49(U0TXD)
UART1_RX: JP13.3 U7.7(GPIO2)
UART1_TX: JP13.2 U7.9(GPIO4)
VSPI_CLK: JP7.3 U7.45(MTDO)
VSPI_CS0: JP7.2 U7.48(MTMS)
VSPI_MISO: JP7.5 U7.47(MTDI)
VSPI_MOSI: JP7.4 U7.43(GPIO38)
NetC51_2: C51.2 J2.1(OSC1) R30.1 U7.54(XTAL_P)
NetC52_2: C52.2 J2.3(OSC2) R30.2 U7.53(XTAL_N)
NetC56_1: C56.1 R27.1 R41.1 U9.8(VCC)
NetC182_2: C182.2 L8.2 U7.2(VDD3P3) U7.3(VDD3P3)
NetQ1_1: Q1.1(B) R24.2
NetQ2_1: Q2.1(B) R28.2
NetR25_1: R25.1 U6.26(TXD)
NetR26_1: R26.1 U6.25(RXD)
NetR31_1: R31.1 U6.9(~{RST})
NetR36_1: R36.1 U7.51(GPIO45)
NetR43_2: R43.2 U10.8(RS)
NetR44_1: R44.1 U11.23(~{OE})
NetR45_1: R45.1 U12.1(OE/~{ST})

Not connected (* = marked no-connect by the designer): U4 1(D0)* 2(VCC)* 3(RX)* 4(TX)* 5(GND)* 6(D1)* 7(D3)* 12(D2)*; U6 1(DCD)* 2(RI)* 10(NC)* 11(~{SUSPEND})* 12(SUSPEND)* 13(NC)* 14(NC)* 15(NC)* 16(NC)* 17(NC)* 18(NC/VPP)* 19(NC)* 20(NC)* 21(NC)* 22(NC)* 23(CTS)* 27(DSR)*; U7 21(XTAL_32K_P)* 22(XTAL_32K_N)* 27(GPIO21)* 28(SPICS1)* 36(SPICLK_N)* 37(SPICLK_P)* 52(GPIO46)*; U10 5(VREF)*

### Layout directives
differential pair: CAN_N, CAN_P, CP2102_USB_N, CP2102_USB_P, ESP32_USB_D_N, ESP32_USB_D_P
net class ESP32_FLASH: SCK/CLK, SCS/CMD, SDI/SD1, SDO/SD0, SHD/SD2, SWP/SD3

### Library data of the parts
B2 B3 = Bottom-2P-1Way: as B1 on sheet RV1103; Device: TS342A2P-WZ; LCSC Part Name: 轻触开关 3*4*2 两脚小龟不带柱 250gf 黑色塑胶按钮; Supplier Part: C557591; Manufacturer Part: TS342A2P-WZ; Supplier Footprint: SMD; JLCPCB Part Class: Extended Part; Datasheet: https://atta.szlcsc.com/upload/public/pdf/source/20200519/C557591_B3A5A21584733303F06306F18577DA8B.pdf; Supplier: LCSC; Convert to PCB: yes
C34 C43-C54 C56-C59 C182-C188 C201-C203 C209 = SMT_Cap: 贴片电容; ComponentLink1Description: 供应商链接; ComponentLink1URL: http://www.szlcsc.com/product/details_29010.html; Package: 0805; Supplier: LC; SuppliersPartNumber: C28260
CR1-CR28 = LESD5D5.0CT1G: TVS; Mfr_Name: UMW(Youtai Semiconductor Co., Ltd.); Type: Current Regulation - Diodes, Transistors
J2 = Oscillator_SMT_4P
JP7 = Header 6: as JP2 on sheet RV1103; BOM名称: 6P接插件
JP8 JP9 JP13 = Header 4: as JP1 on sheet RV1103; BOM名称: 4P接插件
L1 L8 = SMT_Iud: 贴片电感; ComponentLink1Description: 供应商链接; ComponentLink1URL: http://www.szlcsc.com/product/details_30010.html; Package: 0603; Supplier: LC; SuppliersPartNumber: C29258
P3 = IDC 2x17P
Q1 Q2 = CMP-20235-000001-1: NPN TRANSISTOR 1.5A 40V SOT-23 R; Transition Frequency: 100MHz; Max Breakdown Voltage: 25V; Collector Emitter Voltage (VCEO): 400mV; Max Power Dissipation: 300mW; Max Collector Current: 1.5A; Case/Package: TO-236-3; Packaging: Tape and Reel; RoHS Compliant: Yes; Mount: Surface Mount; Collector Emitter Breakdown Voltage: 25V
R21 R22 R24-R31 R36 R41-R45 R99 R103 = SMT_Res: 贴片电阻; ComponentLink1Description: 供应商链接; ComponentLink1URL: http://www.szlcsc.com/product/details_23980.html; Package: 0603; Supplier: LC; SuppliersPartNumber: C23253
U4 = 9轴加速度计
U6 = CP2102: SINGLE-CHIP USB TO UART BRIDGE
U7 = ESP32-S3R8: ESP32-S3R8 RF System; NexarPartId: 118292493
U9 = W25Q128JVPIQ: The W25Q128JV (128M-bit) Serial Flash memory provides a storage solution for systems with limited / space, pins and power.
U10 = CMP-0315-00046-3: CAN Bus Transceiver, 3.3 V, -40 to 85 degC, 8-Pin SOIC (D), Green (RoHS & no Sb/Br), Tube; Supply Voltage Min: 3 V; Supply Voltage Max: 3.6 V; PartNumber: SN65HVD230D; ComponentLink2URL: http://www.ti.com/general/docs/lit/getliterature.tsp?genericGeneric Part Number=SN65HVD230&fileType=pdf; DatasheetVersion: SLOS346N; Generic Part Number: SN65HVD230; Packing: Tube; Temperature Min: -40 degC; Temperature Max: 85 degC; ComponentLink1Description: Manufacturer URL; Mounting Technology: Surface Mount; RoHS: TRUE; ComponentLink1URL: http://www.ti.com/; ComponentLink2Description: Datasheet; PackageDescription: 8-Pin Plastic Small Outline, Body 4.9 x 3.9 mm, Pitch 1.27 mm
U11 = PCA9685PW: 16-Channel, 12-bit PWM Fm+ I²C-Bus LED Driver
U12 = SG-8018CG_50Mhz: CRYSTAL OSCILLATOR (Programmable)

## Sheet Power.SchDoc
size A2; SheetNumber: 3; SheetTotal: 4
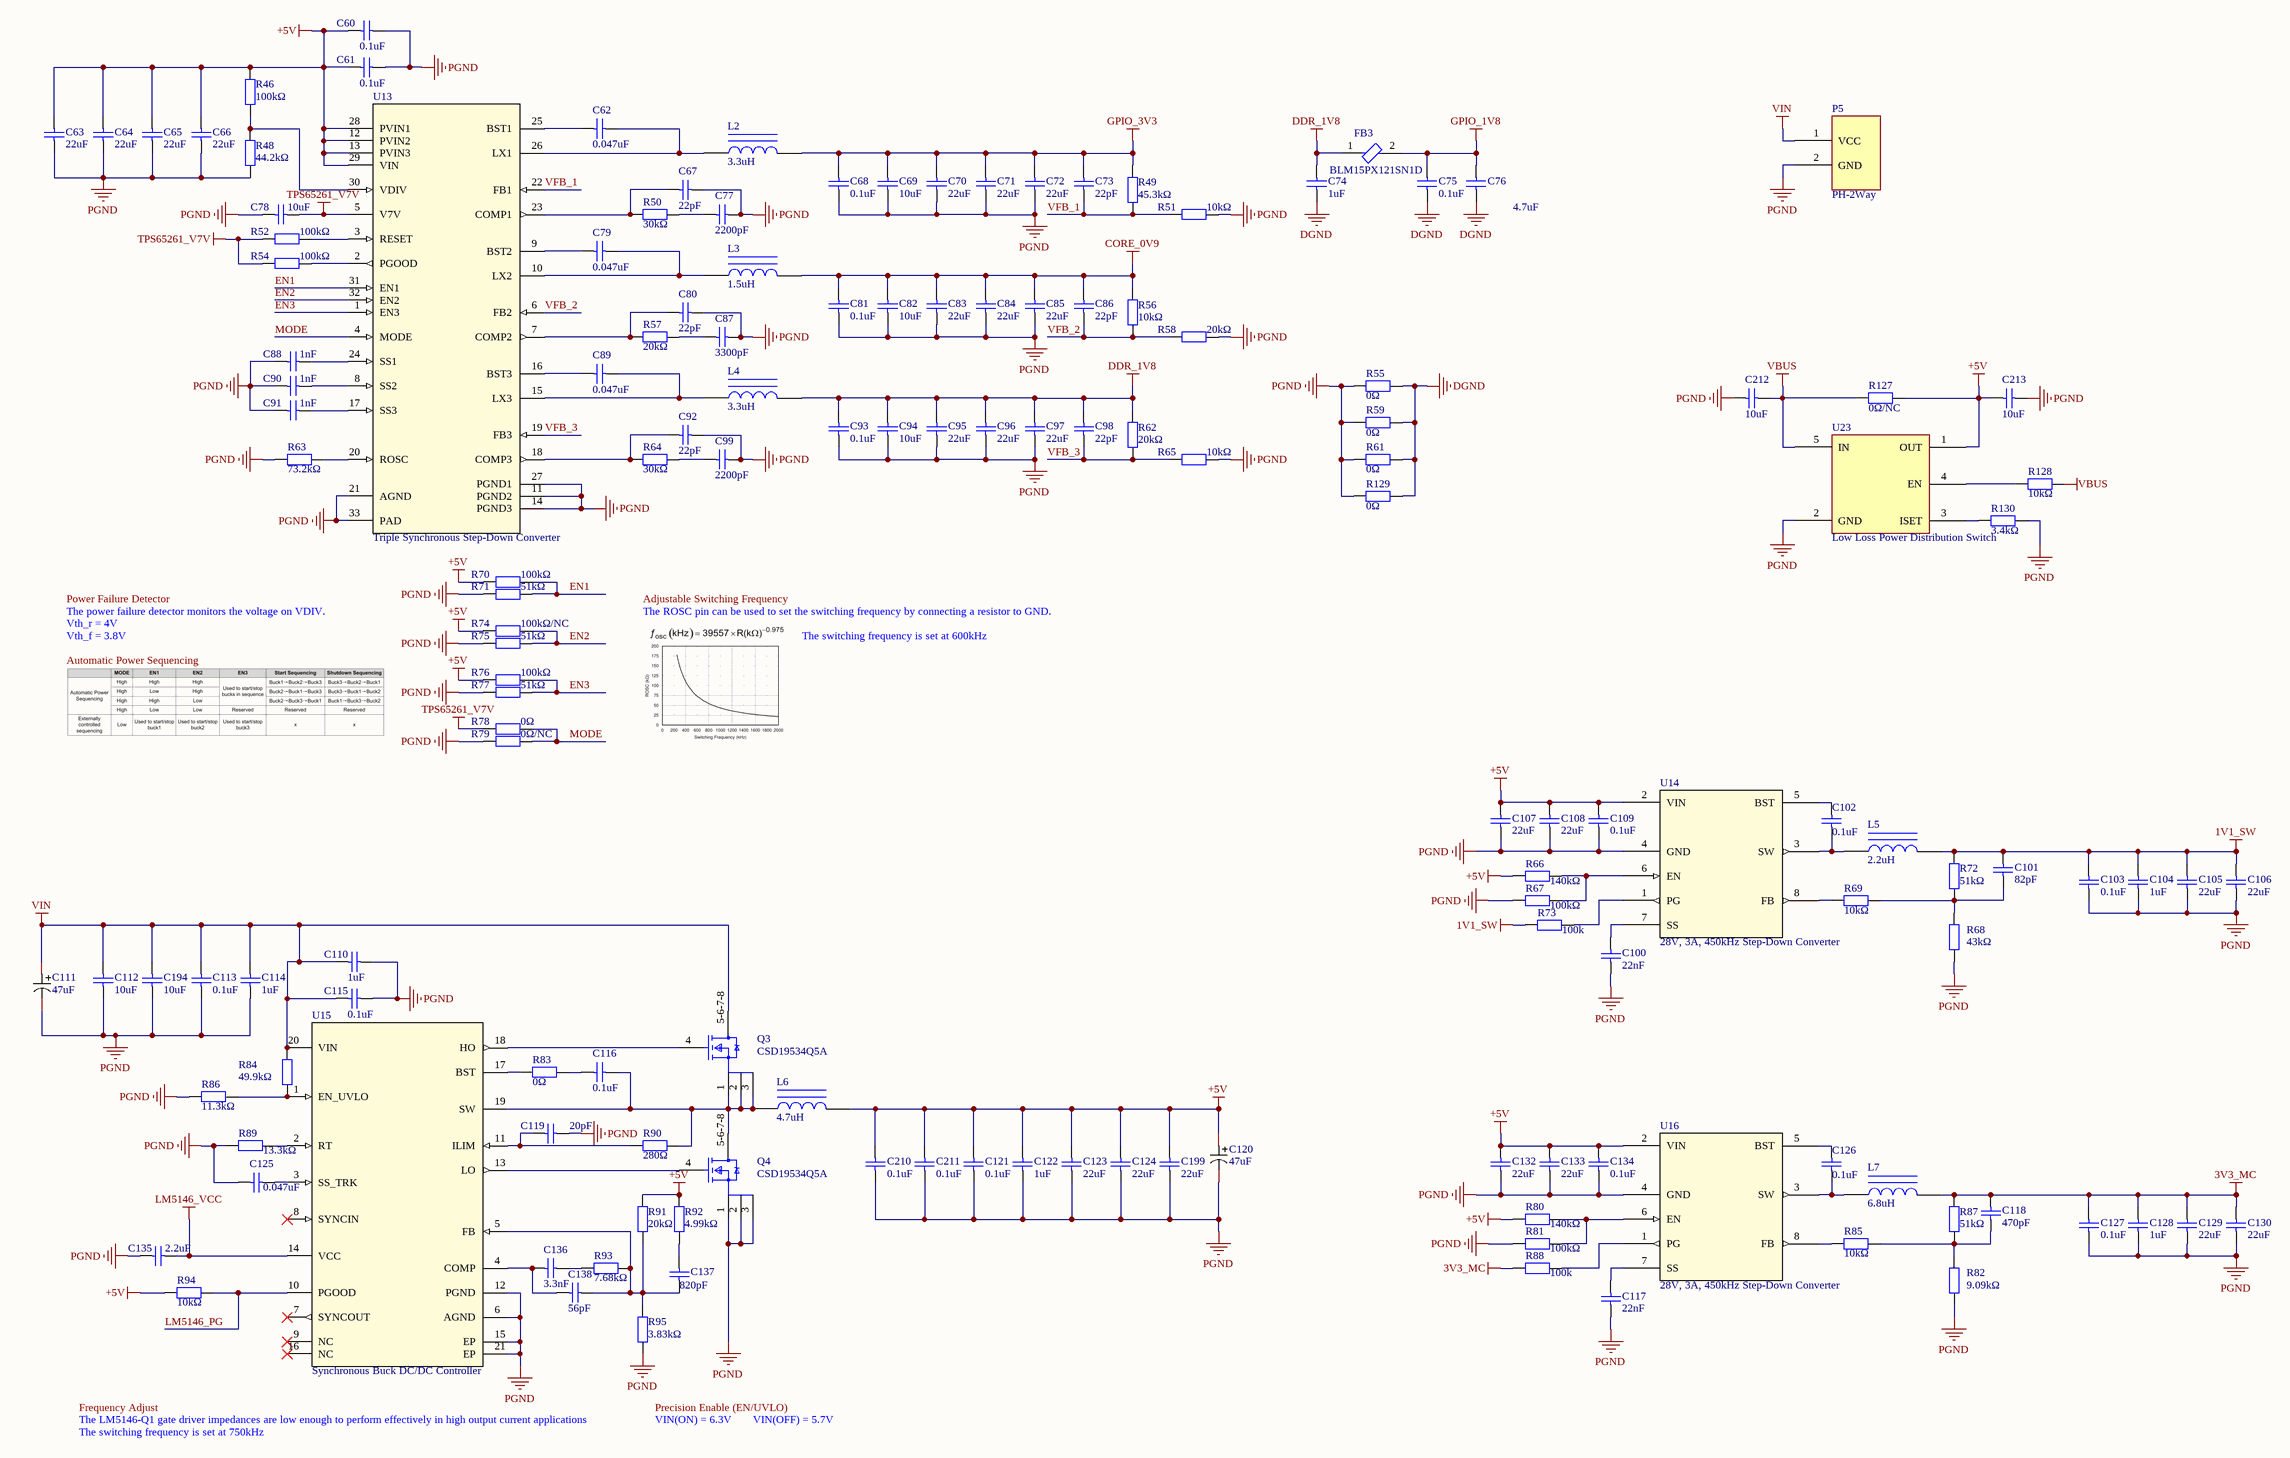
[diagram p4: Power.SchDoc]

### Parts
C60  0.1uF  [0603_C]
C61  0.1uF  [0603_C]
C62  0.047uF  [0402_C]
C63  22uF  [1206_C]
C64  22uF  [1206_C]
C65  22uF  [1206_C]
C66  22uF  [1206_C]
C67  22pF  [0402_C]
C68  0.1uF  [0603_C]
C69  10uF  [0603_C]
C70  22uF  [1206_C]
C71  22uF  [1206_C]
C72  22uF  [1206_C]
C73  22pF  [0402_C]
C74  1uF  [0402_C]
C75  0.1uF  [0402_C]
C76  4.7uF  [0402_C]
C77  2200pF  [0402_C]
C78  10uF  [0603_C]
C79  0.047uF  [0402_C]
C80  22pF  [0402_C]
C81  0.1uF  [0603_C]
C82  10uF  [0603_C]
C83  22uF  [1206_C]
C84  22uF  [1206_C]
C85  22uF  [1206_C]
C86  22pF  [0402_C]
C87  3300pF  [0402_C]
C88  1nF  [0402_C]
C89  0.047uF  [0402_C]
C90  1nF  [0402_C]
C91  1nF  [0402_C]
C92  22pF  [0402_C]
C93  0.1uF  [0603_C]
C94  10uF  [0603_C]
C95  22uF  [1206_C]
C96  22uF  [1206_C]
C97  22uF  [1206_C]
C98  22pF  [0402_C]
C99  2200pF  [0402_C]
C100  22nF  [0402_C]
C101  82pF  [0402_C]
C102  0.1uF  [0603_C]
C103  0.1uF  [0603_C]
C104  1uF  [0603_C]
C105  22uF  [1206_C]
C106  22uF  [1206_C]
C107  22uF  [1206_C]
C108  22uF  [1206_C]
C109  0.1uF  [0603_C]
C110  1uF  [0402_C]
C111  47uF  [CM D(6.3*5.4)]
C112  10uF  [0603_C]
C113  0.1uF  [0603_C]
C114  1uF  [0603_C]
C115  0.1uF  [0402_C]
C116  0.1uF  [0402_C]
C117  22nF  [0402_C]
C118  470pF  [0402_C]
C119  20pF  [0402_C]
C120  47uF  [CM D(6.3*5.4)]
C121  0.1uF  [0603_C]
C122  1uF  [0603_C]
C123  22uF  [1206_C]
C124  22uF  [1206_C]
C125  0.047uF  [0402_C]
C126  0.1uF  [0603_C]
C127  0.1uF  [0603_C]
C128  1uF  [0603_C]
C129  22uF  [1206_C]
C130  22uF  [1206_C]
C132  22uF  [1206_C]
C133  22uF  [1206_C]
C134  0.1uF  [0603_C]
C135  2.2uF  [0805_C]
C136  3.3nF  [0402_C]
C137  820pF  [0402_C]
C138  56pF  [0402_C]
C194  10uF  [0603_C]
C199  22uF  [1206_C]
C210  0.1uF  [0603_C]
C211  0.1uF  [0603_C]
C212  10uF  [1206_C]
C213  10uF  [1206_C]
FB3  BLM15PX121SN1D  [FP-BLM15-0_05-d0_7-MFG]
L2  3.3uH  [FTC_3030]
L3  1.5uH  [FTC_3030]
L4  3.3uH  [FTC_3030]
L5  2.2uH  [FTC_3030]
L6  4.7uH  [INDM113101X40N]
L7  6.8uH  [FTC_3030]
P5  PH-2Way  [XT30-F]
Q3  CSD19534Q5A  [FP-DQJ0008A-MFG]
Q4  CSD19534Q5A  [FP-DQJ0008A-MFG]
R46  100kΩ  [0402_R]
R48  44.2kΩ  [0402_R]
R49  45.3kΩ  [0402_R]
R50  30kΩ  [0402_R]
R51  10kΩ  [0402_R]
R52  100kΩ  [0402_R]
R54  100kΩ  [0402_R]
R55  0Ω  [1206_R]
R56  10kΩ  [0402_R]
R57  20kΩ  [0402_R]
R58  20kΩ  [0402_R]
R59  0Ω  [1206_R]
R61  0Ω  [1206_R]
R62  20kΩ  [0402_R]
R63  73.2kΩ  [0402_R]
R64  30kΩ  [0402_R]
R65  10kΩ  [0402_R]
R66  140kΩ  [0402_R]
R67  100kΩ  [0402_R]
R68  43kΩ  [0402_R]
R69  10kΩ  [0402_R]
R70  100kΩ  [0402_R]
R71  51kΩ  [0402_R]
R72  51kΩ  [0402_R]
R73  100k  [0402_R]
R74  100kΩ/NC  [0402_R]
R75  51kΩ  [0402_R]
R76  100kΩ  [0402_R]
R77  51kΩ  [0402_R]
R78  0Ω  [0402_R]
R79  0Ω/NC  [0402_R]
R80  140kΩ  [0402_R]
R81  100kΩ  [0402_R]
R82  9.09kΩ  [0402_R]
R83  0Ω  [0402_R]
R84  49.9kΩ  [0402_R]
R85  10kΩ  [0402_R]
R86  11.3kΩ  [0402_R]
R87  51kΩ  [0402_R]
R88  100k  [0402_R]
R89  13.3kΩ  [0402_R]
R90  280Ω  [0402_R]
R91  20kΩ  [0402_R]
R92  4.99kΩ  [0402_R]
R93  7.68kΩ  [0402_R]
R94  10kΩ  [0402_R]
R95  3.83kΩ  [0402_R]
R127  0Ω/NC  [1206_R]
R128  10kΩ  [0603_R]
R129  0Ω  [1206_R]
R130  3.4kΩ  [0603_R]
U13  Triple Synchronous Step-Down Converter  [QFN50P500X500X100_HS-33N]
U14  28V, 3A, 450kHz Step-Down Converter  [SOT583_MP2338_MNP]
U15  Synchronous Buck DC/DC Controller  [RGY0020B]
U16  28V, 3A, 450kHz Step-Down Converter  [SOT583_MP2338_MNP]
U23  Low Loss Power Distribution Switch  [SOT95P285X130-5N]

### Nets
1V1_SW: C101.2 C103.2 C104.2 C105.2 C106.2 L5.2 R72.2 R73.1
3V3_MC: C118.2 C127.2 C128.2 C129.2 C130.2 L7.2 R87.2 R88.1
+5V: C60.2 C61.2 C63.2 C64.2 C65.2 C66.2 C107.2 C108.2 C109.2 C120.1 C121.2 C122.2 C123.2 C124.2 C132.2 C133.2 C134.2 C199.2 C210.2 C211.2 C213.1 L6.2 R46.2 R66.2 R70.1 R74.1 R76.1 R80.2 R91.2 R92.2 R94.2 R127.2 U13.12(PVIN2) U13.13(PVIN3) U13.28(PVIN1) U13.29(VIN) U14.2(VIN) U16.2(VIN) U23.1(OUT)
CORE_0V9: C81.2 C82.2 C83.2 C84.2 C85.2 C86.2 L3.2 R56.2
DDR_1V8: C74.2 C93.2 C94.2 C95.2 C96.2 C97.2 C98.2 FB3.1 L4.2 R62.2
DGND: C74.1 C75.1 C76.1 R55.2 R59.2 R61.2 R129.2
GPIO_1V8: C75.2 C76.2 FB3.2
GPIO_3V3: C68.2 C69.2 C70.2 C71.2 C72.2 C73.2 L2.2 R49.2
LM5146_VCC: C135.1 U15.14(VCC)
PGND: C60.1 C61.1 C63.1 C64.1 C65.1 C66.1 C67.2 C68.1 C69.1 C70.1 C71.1 C72.1 C77.2 C78.1 C80.2 C81.1 C82.1 C83.1 C84.1 C85.1 C87.2 C88.1 C90.1 C91.1 C92.2 C93.1 C94.1 C95.1 C96.1 C97.1 C99.2 C100.1 C103.1 C104.1 C105.1 C106.1 C107.1 C108.1 C109.1 C110.1 C111.2 C112.2 C113.2 C114.2 C115.1 C117.2 C119.2 C120.2 C121.1 C122.1 C123.1 C124.1 C125.2 C127.1 C128.1 C129.1 C130.1 C132.1 C133.1 C134.1 C135.2 C194.2 C199.1 C210.1 C211.1 C212.2 C213.2 P5.2(GND) Q4.1(S) Q4.2(S) Q4.3(S) R48.1 R51.1 R55.1 R58.1 R59.1 R61.1 R63.1 R65.1 R67.2 R68.1 R71.2 R75.2 R77.2 R79.2 R81.2 R82.1 R86.2 R89.2 R95.1 R129.1 R130.1 U13.11(PGND2) U13.14(PGND3) U13.21(AGND) U13.27(PGND1) U13.33(PAD) U14.4(GND) U15.6(AGND) U15.12(PGND) U15.15(EP) U15.21(EP) U16.4(GND) U23.2(GND)
TPS65261_V7V: C78.2 R52.1 R54.1 R78.2 U13.5(V7V)
VBUS: C212.1 R127.1 R128.2 U23.5(IN)
VIN: C110.2 C111.1 C112.1 C113.1 C114.1 C115.2 C194.1 P5.1(VCC) Q3.5-6-7-8(D) R84.2 U15.20(VIN)
EN1: R70.2 R71.1 U13.31(EN1)
EN2: R74.2 R75.1 U13.32(EN2)
EN3: R76.2 R77.1 U13.1(EN3)
LM5146_PG: R94.1 U15.10(PGOOD)
MODE: R78.1 R79.1 U13.4(MODE)
VFB_1: C73.1 R49.1 R51.2 U13.22(FB1)
VFB_2: C86.1 R56.1 R58.2 U13.6(FB2)
VFB_3: C98.1 R62.1 R65.2 U13.19(FB3)
NetC62_1: C62.1 U13.25(BST1)
NetC62_2: C62.2 L2.1 U13.26(LX1)
NetC67_1: C67.1 R50.1 U13.23(COMP1)
NetC77_1: C77.1 R50.2
NetC79_1: C79.1 U13.9(BST2)
NetC79_2: C79.2 L3.1 U13.10(LX2)
NetC80_1: C80.1 R57.1 U13.7(COMP2)
NetC87_1: C87.1 R57.2
NetC88_2: C88.2 U13.24(SS1)
NetC89_1: C89.1 U13.16(BST3)
NetC89_2: C89.2 L4.1 U13.15(LX3)
NetC90_2: C90.2 U13.8(SS2)
NetC91_2: C91.2 U13.17(SS3)
NetC92_1: C92.1 R64.1 U13.18(COMP3)
NetC99_1: C99.1 R64.2
NetC100_2: C100.2 U14.7(SS)
NetC101_1: C101.1 R68.2 R69.1 R72.1
NetC102_1: C102.1 L5.1 U14.3(SW)
NetC102_2: C102.2 U14.5(BST)
NetC116_1: C116.1 R83.2
NetC116_2: C116.2 L6.1 Q3.1(S) Q3.2(S) Q3.3(S) Q4.5-6-7-8(D) R90.2 U15.19(SW)
NetC117_1: C117.1 U16.7(SS)
NetC118_1: C118.1 R82.2 R85.1 R87.1
NetC119_1: C119.1 R90.1 U15.11(ILIM)
NetC125_1: C125.1 U15.3(SS_TRK)
NetC126_1: C126.1 L7.1 U16.3(SW)
NetC126_2: C126.2 U16.5(BST)
NetC136_1: C136.1 R93.2
NetC136_2: C136.2 C138.2 U15.4(COMP)
NetC137_1: C137.1 C138.1 R91.1 R93.1 R95.2 U15.5(FB)
NetC137_2: C137.2 R92.1
NetQ3_4: Q3.4(G) U15.18(HO)
NetQ4_4: Q4.4(G) U15.13(LO)
NetR46_1: R46.1 R48.2 U13.30(VDIV)
NetR52_2: R52.2 U13.3(RESET)
NetR54_2: R54.2 U13.2(PGOOD)
NetR63_2: R63.2 U13.20(ROSC)
NetR66_1: R66.1 R67.1 U14.6(EN)
NetR69_2: R69.2 U14.8(FB)
NetR73_2: R73.2 U14.1(PG)
NetR80_1: R80.1 R81.1 U16.6(EN)
NetR83_1: R83.1 U15.17(BST)
NetR84_1: R84.1 R86.1 U15.1(EN_UVLO)
NetR85_2: R85.2 U16.8(FB)
NetR88_2: R88.2 U16.1(PG)
NetR89_1: R89.1 U15.2(RT)
NetR128_1: R128.1 U23.4(EN)
NetR130_2: R130.2 U23.3(ISET)

Not connected (* = marked no-connect by the designer): U15 7(SYNCOUT)* 8(SYNCIN)* 9(NC)* 16(NC)*

### Notes on the sheet
- Power Failure Detector
- The power failure detector monitors the voltage on VDIV.
- Vth_r = 4V
- Vth_f = 3.8V
- Adjustable Switching Frequency
- The ROSC pin can be used to set the switching frequency by connecting a resistor to GND.
- The switching frequency is set at 600kHz
- Automatic Power Sequencing
- The LM5146-Q1 gate driver impedances are low enough to perform effectively in high output current applications
- Frequency Adjust
- The switching frequency is set at 750kHz
- Precision Enable (EN/UVLO)
- VIN(ON) = 6.3V
- VIN(OFF) = 5.7V

### Library data of the parts
C60-C110 C112-C119 C121-C130 C132-C138 C194 C199 C210-C213 = SMT_Cap: 贴片电容; ComponentLink1Description: 供应商链接; ComponentLink1URL: http://www.szlcsc.com/product/details_29010.html; Package: 0805; Supplier: LC; SuppliersPartNumber: C28260
C111 C120 = SMT_Cap_Electrolytic: 贴片电容; ComponentLink1Description: 供应商链接; ComponentLink1URL: http://www.szlcsc.com/product/details_29010.html; Package: 0805; Supplier: LC; SuppliersPartNumber: C28260
FB3 = CMP-0686-00133-3: as FB1 on sheet RV1103; Lead Free: Lead Free; Package Quantity: 10000; Width: 0.5mm; Case Code (Metric): 1005; Test Frequency: 100MHz; Weight: 2.3E-05oz; Max DC Current: 2A; Current Rating: 2A; REACH SVHC: No SVHC; Case Code (Imperial): 0402; Min Operating Temperature: -55°C; Max Operating Temperature: 125°C; Max Current Rating: 2A; Series: EMIFIL®, BLM15P; Tolerance: 25%; Termination: SMD/SMT; Number of Lines: 1; Case/Package: 0402; RoHS Compliant: Yes; Number of Pins: 2; Length: 1mm; Height: 0.5mm; Packaging: Tape and Reel
L2-L7 = SMT_Iud_Power: 功率电感; ComponentLink1Description: 供应商链接; ComponentLink1URL: http://www.szlcsc.com/product/details_30010.html; Package: 0603; Supplier: LC; SuppliersPartNumber: C29258
Q3 Q4 = CMP-04962-000018-1: MOSFET N-CH 100V 50 8SON; Manufacturer: Texas Instruments; Reverse Recovery Time: 53ns; Turn Off Delay Time: 20ns; Gate To Source Voltage: 20V; Turn On Delay Time: 9ns; Depletion Mode: False; Threshold Vgs Max: 3.4V; Pulse Drain Current: 137A; Number Of N Channels: 1; Input Capacitace At Vds: 1290pF @ 50V; Max Junction Temp: +150°C; Power Dissipation: 3.2W; Max Forward Diode Voltage: 1V; Continuous Drain Current: 10A; Drain To Source Resistance: 12.6mΩ; Threshold Vgs Min: 2.4V; Transconductance: 47S; Gate Charge At Vgs: 17nC @ 10V; Reverse Recovery Charge: 134nC; Typ Forward Diode Voltage: 0.8V; Rthja Max: 50°C/W; Drain To Source Breakdown Voltage: 100V; Device Class L2: Transistors; Height: 1.1mm; Temperature Range Low: -55°C; Temperature Range High: +150°C; Temperature: -55°C to +150°C; Device Class L1: Discrete Semiconductors; ComponentLink2Description: Datasheet; Number Of Channels: 1; Lead Free: Yes; Octopart: https://octopart.com/csd19534q5a-texas+instruments-46749514; Package: DQJ0008A; Category: Trans; Mouser Description: MOSFET N-Channel MOSFET; Device Class L3: MOSFETs; Digikey Description: MOSFET N-CH 100V 50 8SON; Drain To Source Voltage: 100V; Automotive: No; ComponentLink2URL: http://www.ti.com/lit/ds/symlink/csd19534q5a.pdf; RoHS: TRUE; Manufacturer Part Number: CSD19534Q5A
R46 R48-R52 R54-R59 R61-R95 R127-R130 = SMT_Res: 贴片电阻; ComponentLink1Description: 供应商链接; ComponentLink1URL: http://www.szlcsc.com/product/details_23980.html; Package: 0603; Supplier: LC; SuppliersPartNumber: C23253
U13 = TPS65261RHBR: The TPS65261, TPS65261-1 is a monolithic triple / synchronous step-down (buck) converter with 3- / A/2-A/2-A output currents. A wide 4.5-V to 18- / V input supply voltage range encompasses the / most intermediate bus voltages operating off 5- / V, 9-V, 12-V or 15-V power bus.; Mfr_Name: Texas Instruments; Alternate_Manufacturer: None; CurrentTime: Not shown in title block; DocumentNumber: 1; SymbolCreator: a0411947; CompType: IC; U/M: EA; Designator: U?; CurrentDate: Not shown in title block; Time: Not shown in title block; Date: Not shown in title block; DocumentFullPathAndName: Not shown in title block; DocumentName: Not shown in title block; ModifiedDate: Not shown in title block; ApprovedBy: Not shown in title block; CheckedBy: Not shown in title block; Author: Not shown in title block; CompanyName: Not shown in title block; Engineer: Not shown in title block; Organization: Not shown in title block; Address1: Not shown in title block; Address2: Not shown in title block; Address3: Not shown in title block; Address4: Not shown in title block; Revision: Use project parameter SCH_Rev; SheetNumber: 1; SheetTotal: 1; ImagePath: Not shown in title block; Rule: *; ProjectName: *; SymbolVersion: 2014-02-22; PartNumber: TPS65261RHB; PackageReference: RHB0032E; MountType: SMT; ComponentLink1Description: Datasheet Link; ComponentLink1URL: http://www.ti.com/lit/ds/symlink/tps65261.pdf; RoHS: Y; Publisher: Texas Instruments; LatestRevisionDate: 2014-04-14; Manufacturer: Texas Instruments; RefDes: Refdes; Type: Type
U14 U16 = MP2338GTL-P: High-Efficiency, 28V, 3A, 450kHz, / Synchronous Step-Down Converter / In SOT583 Package; Mfr_Name: Monolithic Power Systems; RefDes: RefDes; Type: Type
U15 = LM5146QRGYRQ1: The LM5146 100-V synchronous buck controller / regulates from a high input voltage source or from an / input rail subject to high-voltage transients, minimizing / the need for external surge suppression components.; Mfr_Name: Texas Instruments; TYPE: TYPE; RefDes: RefDes
U23 = SY6280: The SY6280 develops ultra-low Rds(on) switch with / programmable current limiting to protect the power / source from over current and short circuit conditions.

## Sheet Communication_Management.SchDoc
size A2; SheetNumber: 4; SheetTotal: 4
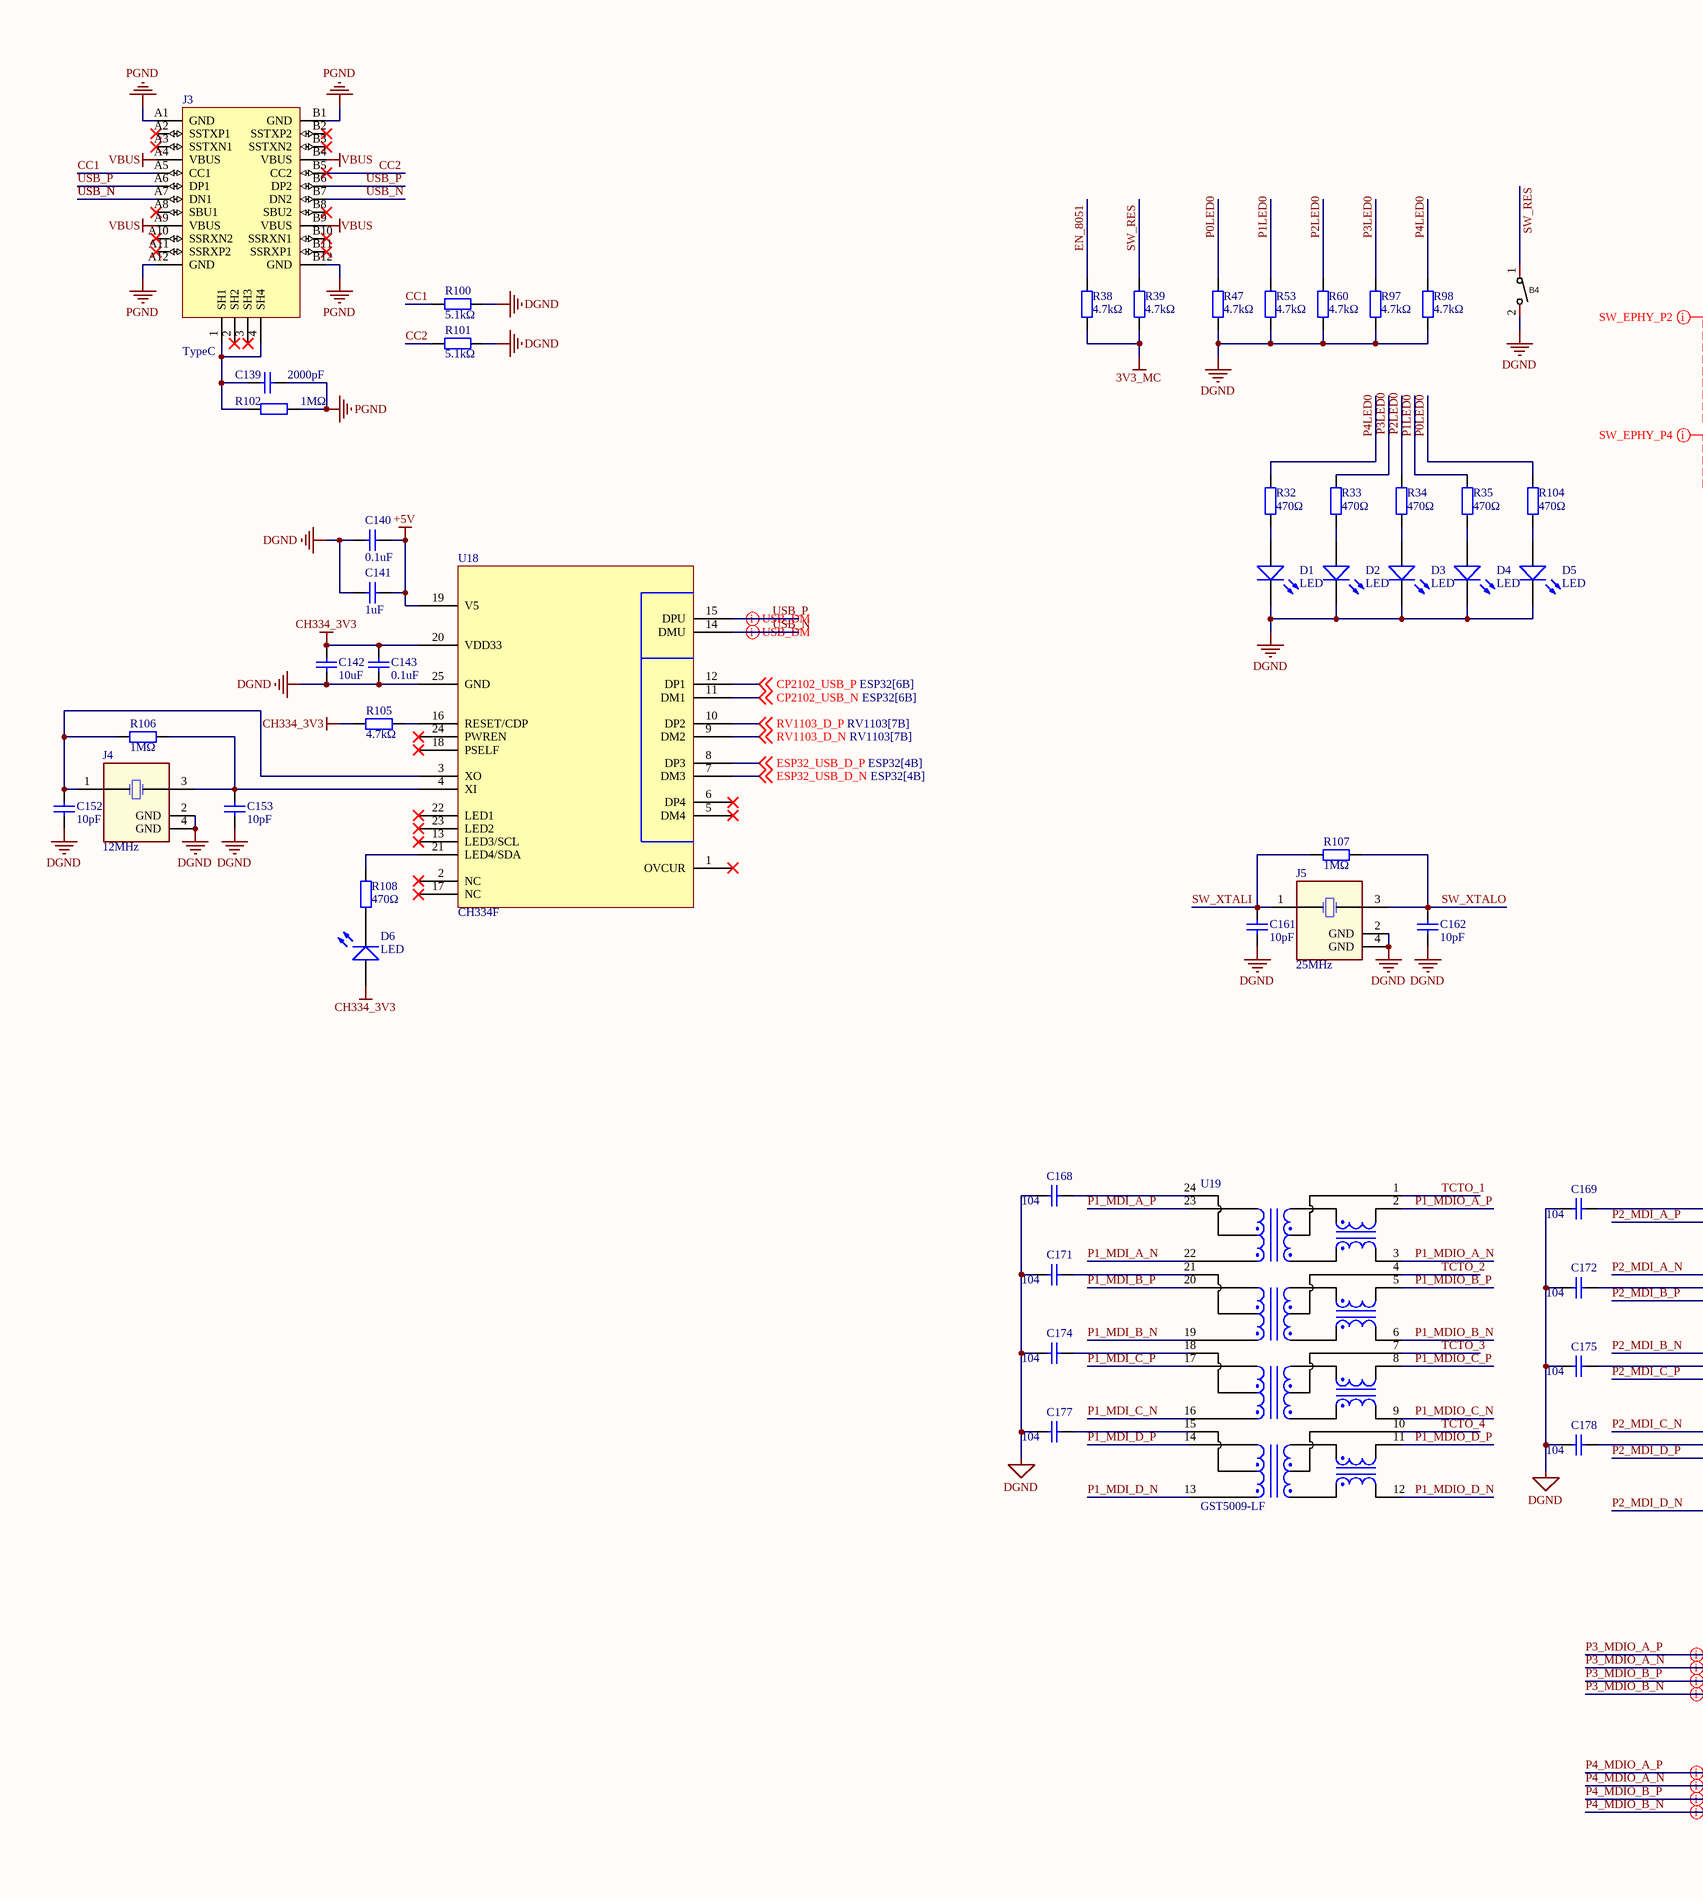
[diagram p5: Communication_Management.SchDoc, left]
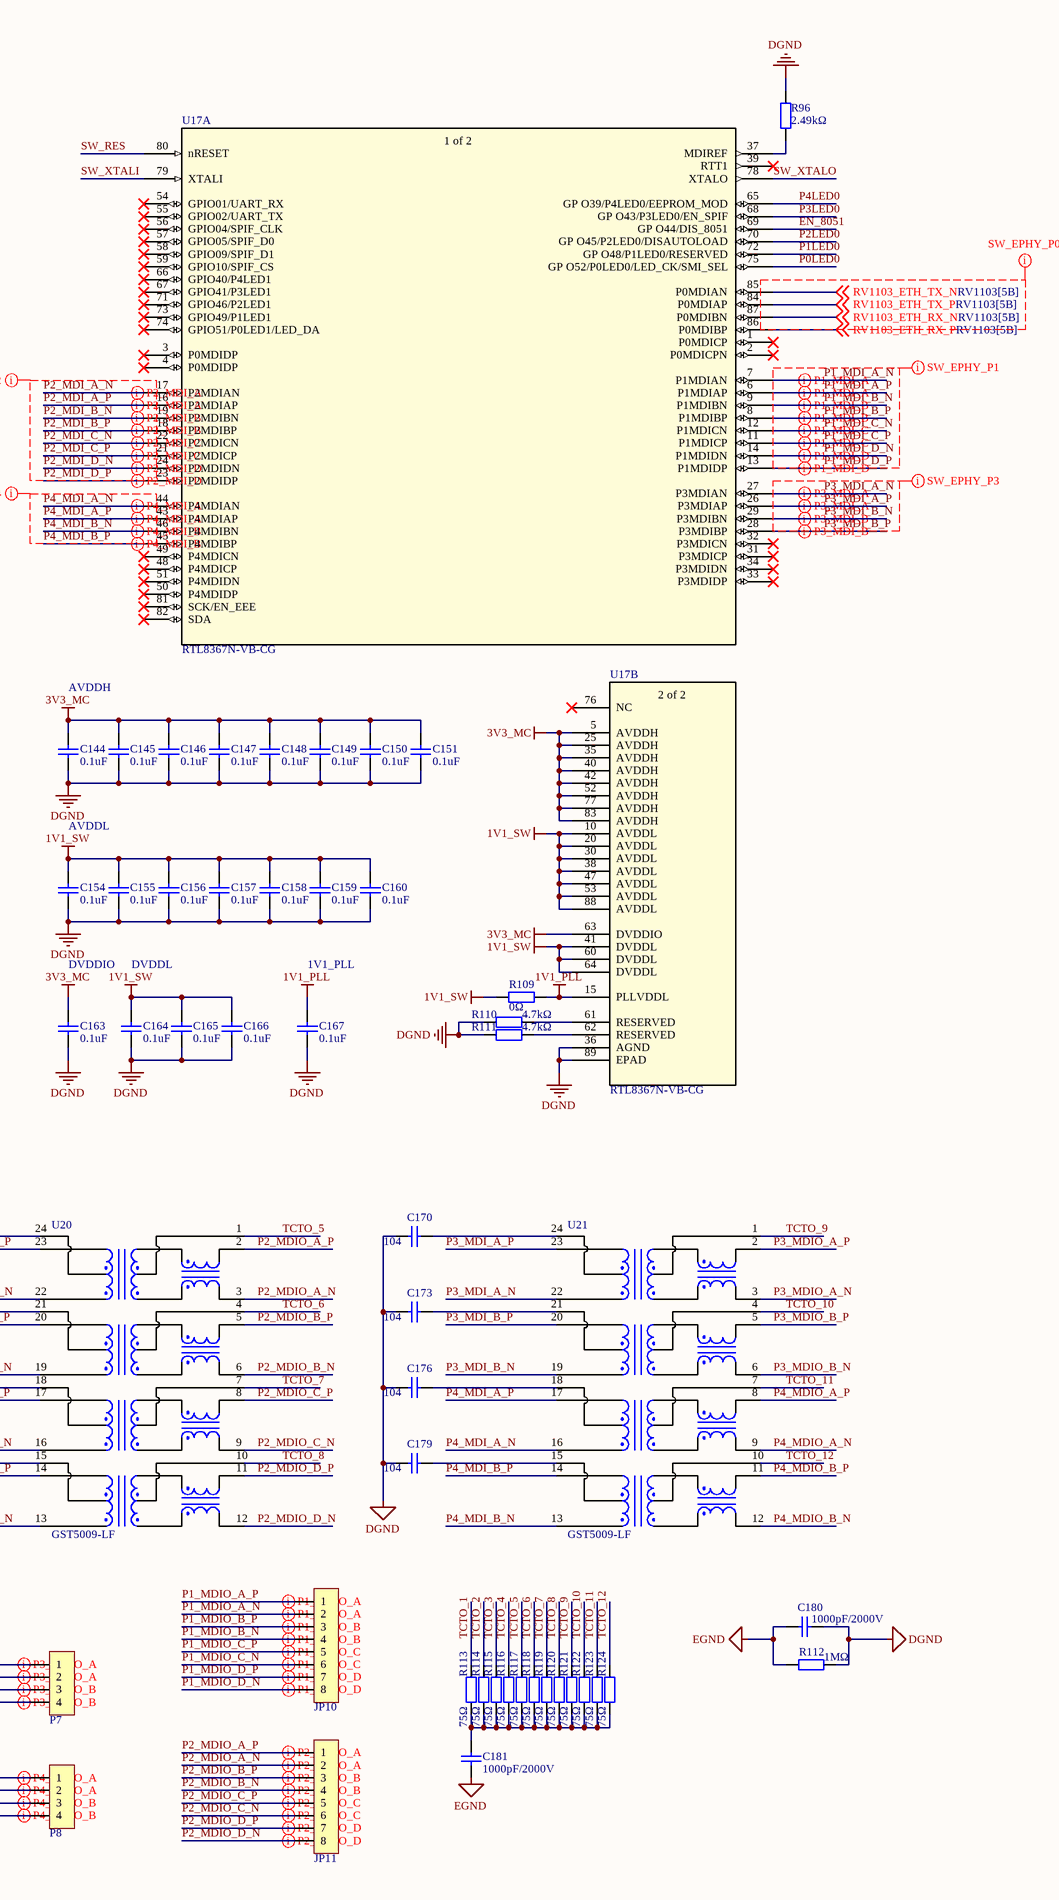
[diagram p6: Communication_Management.SchDoc, right]

### Parts
B4  Bottom-2P-1Way  [SW-SMD_L4.0-W2.9-LS5.0]  (value not drawn)
C139  2000pF  [1210_C]
C140  0.1uF  [0603_C]
C141  1uF  [0603_C]
C142  10uF  [0603_C]
C143  0.1uF  [0603_C]
C144  0.1uF  [0402_C]
C145  0.1uF  [0402_C]
C146  0.1uF  [0402_C]
C147  0.1uF  [0402_C]
C148  0.1uF  [0402_C]
C149  0.1uF  [0402_C]
C150  0.1uF  [0402_C]
C151  0.1uF  [0402_C]
C152  10pF  [0603_C]
C153  10pF  [0603_C]
C154  0.1uF  [0402_C]
C155  0.1uF  [0402_C]
C156  0.1uF  [0402_C]
C157  0.1uF  [0402_C]
C158  0.1uF  [0402_C]
C159  0.1uF  [0402_C]
C160  0.1uF  [0402_C]
C161  10pF  [0402_C]
C162  10pF  [0402_C]
C163  0.1uF  [0402_C]
C164  0.1uF  [0402_C]
C165  0.1uF  [0402_C]
C166  0.1uF  [0402_C]
C167  0.1uF  [0402_C]
C168  104  [0402_C]
C169  104  [0402_C]
C170  104  [0402_C]
C171  104  [0402_C]
C172  104  [0402_C]
C173  104  [0402_C]
C174  104  [0402_C]
C175  104  [0402_C]
C176  104  [0402_C]
C177  104  [0402_C]
C178  104  [0402_C]
C179  104  [0402_C]
C180  1000pF/2000V  [1210_C]
C181  1000pF/2000V  [1210_C]
D1  LED  [0603_LED]
D2  LED  [0603_LED]
D3  LED  [0603_LED]
D4  LED  [0603_LED]
D5  LED  [0603_LED]
D6  LED  [0603_LED]
J3  TypeC  [TYPE-C 16P]
J4  12MHz  [SMD-2520_4P]
J5  25MHz  [SMD-2520_4P]
JP10  HDR-1X8  [MX 1.25-LI-8P]  (value not drawn)
JP11  HDR-1X8  [MX 1.25-LI-8P]  (value not drawn)
P7  HDR-1X4  [MX 1.25-LI-4P]  (value not drawn)
P8  HDR-1X4  [MX 1.25-LI-4P]  (value not drawn)
R32  470Ω  [0603_R]
R33  470Ω  [0603_R]
R34  470Ω  [0603_R]
R35  470Ω  [0603_R]
R38  4.7kΩ  [0402_R]
R39  4.7kΩ  [0402_R]
R47  4.7kΩ  [0402_R]
R53  4.7kΩ  [0402_R]
R60  4.7kΩ  [0402_R]
R96  2.49kΩ  [0402_R]
R97  4.7kΩ  [0402_R]
R98  4.7kΩ  [0402_R]
R100  5.1kΩ  [0603_R]
R101  5.1kΩ  [0603_R]
R102  1MΩ  [1206_R]
R104  470Ω  [0603_R]
R105  4.7kΩ  [0603_R]
R106  1MΩ  [0603_R]
R107  1MΩ  [0603_R]
R108  470Ω  [0603_R]
R109  0Ω  [0402_R]
R110  4.7kΩ  [0402_R]
R111  4.7kΩ  [0402_R]
R112  1MΩ  [1206_R]
R113  75Ω  [0402_R]
R114  75Ω  [0402_R]
R115  75Ω  [0402_R]
R116  75Ω  [0402_R]
R117  75Ω  [0402_R]
R118  75Ω  [0402_R]
R119  75Ω  [0402_R]
R120  75Ω  [0402_R]
R121  75Ω  [0402_R]
R122  75Ω  [0402_R]
R123  75Ω  [0402_R]
R124  75Ω  [0402_R]
U17  RTL8367N-VB-CG  [QFN88-10x10MM]  (parts A,B of 2)
U18  CH334F  [QFN50P400X400X80_HS-25N]
U19  GST5009-LF  [SOP100P1000X400-24N]
U20  GST5009-LF  [SOP100P1000X400-24N]
U21  GST5009-LF  [SOP100P1000X400-24N]

### Nets
1V1_PLL: C167.2 R109.2 U17.15(PLLVDDL)
1V1_SW: C154.2 C155.2 C156.2 C157.2 C158.2 C159.2 C160.2 C164.2 C165.2 C166.2 R109.1 U17.10(AVDDL) U17.20(AVDDL) U17.30(AVDDL) U17.38(AVDDL) U17.41(DVDDL) U17.47(AVDDL) U17.53(AVDDL) U17.60(DVDDL) U17.64(DVDDL) U17.88(AVDDL)
3V3_MC: C144.2 C145.2 C146.2 C147.2 C148.2 C149.2 C150.2 C151.2 C163.2 R38.2 R39.2 U17.5(AVDDH) U17.25(AVDDH) U17.35(AVDDH) U17.40(AVDDH) U17.42(AVDDH) U17.52(AVDDH) U17.63(DVDDIO) U17.77(AVDDH) U17.83(AVDDH)
+5V: C140.2 C141.2 U18.19(V5)
CH334_3V3: C142.2 C143.2 D6.A R105.1 U18.20(VDD33)
DGND: B4.2 C140.1 C141.1 C142.1 C143.1 C144.1 C145.1 C146.1 C147.1 C148.1 C149.1 C150.1 C151.1 C152.1 C153.1 C154.1 C155.1 C156.1 C157.1 C158.1 C159.1 C160.1 C161.1 C162.1 C163.1 C164.1 C165.1 C166.1 C167.1 C168.2 C169.2 C170.2 C171.2 C172.2 C173.2 C174.2 C175.2 C176.2 C177.2 C178.2 C179.2 C180.1 D1.K D2.K D3.K D4.K D5.K J4.2(GND) J4.4(GND) J5.2(GND) J5.4(GND) R47.1 R53.1 R60.1 R96.2 R97.1 R98.1 R100.1 R101.1 R110.1 R111.1 R112.2 U17.36(AGND) U17.89(EPAD) U18.25(GND)
EGND: C180.2 C181.1 R112.1
PGND: C139.2 J3.A1(GND) J3.A12(GND) J3.B1(GND) J3.B12(GND) R102.2
VBUS: J3.A4(VBUS) J3.A9(VBUS) J3.B4(VBUS) J3.B9(VBUS)
CC1: J3.A5(CC1) R100.2
CC2: J3.B5(CC2) R101.2
CP2102_USB_N: U18.11(DM1) ; off-sheet CP2102_USB_N
CP2102_USB_P: U18.12(DP1) ; off-sheet CP2102_USB_P
EN_8051: R38.1 U17.69(GP_O44/DIS_8051)
ESP32_USB_D_N: U18.7(DM3) ; off-sheet ESP32_USB_D_N
ESP32_USB_D_P: U18.8(DP3) ; off-sheet ESP32_USB_D_P
P0LED0: R47.2 R104.2 U17.75(GP_O52/P0LED0/LED_CK/SMI_SEL)
P1_MDI_A_N: U17.7(P1MDIAN) U19.22
P1_MDI_A_P: U17.6(P1MDIAP) U19.23
P1_MDI_B_N: U17.9(P1MDIBN) U19.19
P1_MDI_B_P: U17.8(P1MDIBP) U19.20
P1_MDI_C_N: U17.12(P1MDICN) U19.16
P1_MDI_C_P: U17.11(P1MDICP) U19.17
P1_MDI_D_N: U17.14(P1MDIDN) U19.13
P1_MDI_D_P: U17.13(P1MDIDP) U19.14
P1_MDIO_A_N: JP10.2 U19.3
P1_MDIO_A_P: JP10.1 U19.2
P1_MDIO_B_N: JP10.4 U19.6
P1_MDIO_B_P: JP10.3 U19.5
P1_MDIO_C_N: JP10.6 U19.9
P1_MDIO_C_P: JP10.5 U19.8
P1_MDIO_D_N: JP10.8 U19.12
P1_MDIO_D_P: JP10.7 U19.11
P1LED0: R35.2 R53.2 U17.72(GP_O48/P1LED0/RESERVED)
P2_MDI_A_N: U17.17(P2MDIAN) U20.22
P2_MDI_A_P: U17.16(P2MDIAP) U20.23
P2_MDI_B_N: U17.19(P2MDIBN) U20.19
P2_MDI_B_P: U17.18(P2MDIBP) U20.20
P2_MDI_C_N: U17.22(P2MDICN) U20.16
P2_MDI_C_P: U17.21(P2MDICP) U20.17
P2_MDI_D_N: U17.24(P2MDIDN) U20.13
P2_MDI_D_P: U17.23(P2MDIDP) U20.14
P2_MDIO_A_N: JP11.2 U20.3
P2_MDIO_A_P: JP11.1 U20.2
P2_MDIO_B_N: JP11.4 U20.6
P2_MDIO_B_P: JP11.3 U20.5
P2_MDIO_C_N: JP11.6 U20.9
P2_MDIO_C_P: JP11.5 U20.8
P2_MDIO_D_N: JP11.8 U20.12
P2_MDIO_D_P: JP11.7 U20.11
P2LED0: R34.2 R60.2 U17.70(GP_O45/P2LED0/DISAUTOLOAD)
P3_MDI_A_N: U17.27(P3MDIAN) U21.22
P3_MDI_A_P: U17.26(P3MDIAP) U21.23
P3_MDI_B_N: U17.29(P3MDIBN) U21.19
P3_MDI_B_P: U17.28(P3MDIBP) U21.20
P3_MDIO_A_N: P7.2 U21.3
P3_MDIO_A_P: P7.1 U21.2
P3_MDIO_B_N: P7.4 U21.6
P3_MDIO_B_P: P7.3 U21.5
P3LED0: R33.2 R97.2 U17.68(GP_O43/P3LED0/EN_SPIF)
P4_MDI_A_N: U17.44(P4MDIAN) U21.16
P4_MDI_A_P: U17.43(P4MDIAP) U21.17
P4_MDI_B_N: U17.46(P4MDIBN) U21.13
P4_MDI_B_P: U17.45(P4MDIBP) U21.14
P4_MDIO_A_N: P8.2 U21.9
P4_MDIO_A_P: P8.1 U21.8
P4_MDIO_B_N: P8.4 U21.12
P4_MDIO_B_P: P8.3 U21.11
P4LED0: R32.2 R98.2 U17.65(GP_O39/P4LED0/EEPROM_MOD)
RV1103_D_N: U18.9(DM2) ; off-sheet RV1103_D_N
RV1103_D_P: U18.10(DP2) ; off-sheet RV1103_D_P
RV1103_ETH_RX_N: U17.87(P0MDIBN) ; off-sheet RV1103_ETH_RX_N
RV1103_ETH_RX_P: U17.86(P0MDIBP) ; off-sheet RV1103_ETH_RX_P
RV1103_ETH_TX_N: U17.85(P0MDIAN) ; off-sheet RV1103_ETH_TX_N
RV1103_ETH_TX_P: U17.84(P0MDIAP) ; off-sheet RV1103_ETH_TX_P
SW_RES: B4.1 R39.1 U17.80(nRESET)
SW_XTALI: C161.2 J5.1(OSC1) R107.1 U17.79(XTALI)
SW_XTALO: C162.2 J5.3(OSC2) R107.2 U17.78(XTALO)
TCTO_1: R113.2 U19.1
TCTO_2: R114.2 U19.4
TCTO_3: R115.2 U19.7
TCTO_4: R116.2 U19.10
TCTO_5: R117.2 U20.1
TCTO_6: R118.2 U20.4
TCTO_7: R119.2 U20.7
TCTO_8: R120.2 U20.10
TCTO_9: R121.2 U21.1
TCTO_10: R122.2 U21.4
TCTO_11: R123.2 U21.7
TCTO_12: R124.2 U21.10
USB_N: J3.A7(DN1) J3.B7(DN2) U18.14(DMU)
USB_P: J3.A6(DP1) J3.B6(DP2) U18.15(DPU)
NetC139_1: C139.1 J3.1(SH1) J3.4(SH4) R102.1
NetC152_2: C152.2 J4.1(OSC1) R106.1 U18.3(XO)
NetC153_2: C153.2 J4.3(OSC2) R106.2 U18.4(XI)
NetC168_1: C168.1 U19.24
NetC169_1: C169.1 U20.24
NetC170_1: C170.1 U21.24
NetC171_1: C171.1 U19.21
NetC172_1: C172.1 U20.21
NetC173_1: C173.1 U21.21
NetC174_1: C174.1 U19.18
NetC175_1: C175.1 U20.18
NetC176_1: C176.1 U21.18
NetC177_1: C177.1 U19.15
NetC178_1: C178.1 U20.15
NetC179_1: C179.1 U21.15
NetC181_2: C181.2 R113.1 R114.1 R115.1 R116.1 R117.1 R118.1 R119.1 R120.1 R121.1 R122.1 R123.1 R124.1
NetD1_A: D1.A R32.1
NetD2_A: D2.A R33.1
NetD3_A: D3.A R34.1
NetD4_A: D4.A R35.1
NetD5_A: D5.A R104.1
NetD6_K: D6.K R108.1
NetR96_1: R96.1 U17.37(MDIREF)
NetR105_2: R105.2 U18.16(RESET/CDP)
NetR108_2: R108.2 U18.21(LED4/SDA)
NetR110_2: R110.2 U17.61(RESERVED)
NetR111_2: R111.2 U17.62(RESERVED)

Not connected (* = marked no-connect by the designer): J3 2(SH2)* 3(SH3)* A2(SSTXP1)* A3(SSTXN1)* A8(SBU1)* A10(SSRXN2)* A11(SSRXP2)* B2(SSTXP2)* B3(SSTXN2)* B8(SBU2)* B10(SSRXN1)* B11(SSRXP1)*; U17 1(P0MDICP)* 2(P0MDICPN)* 3(P0MDIDP)* 4(P0MDIDP)* 31(P3MDICP)* 32(P3MDICN)* 33(P3MDIDP)* 34(P3MDIDN)* 39(RTT1)* 48(P4MDICP)* 49(P4MDICN)* 50(P4MDIDP)* 51(P4MDIDN)* 54(GPIO01/UART_RX)* 55(GPIO02/UART_TX)* 56(GPIO04/SPIF_CLK)* 57(GPIO05/SPIF_D0)* 58(GPIO09/SPIF_D1)* 59(GPIO10/SPIF_CS)* 66(GPIO40/P4LED1)* 67(GPIO41/P3LED1)* 71(GPIO46/P2LED1)* 73(GPIO49/P1LED1)* 74(GPIO51/P0LED1/LED_DA)* 76(NC)* 81(SCK/EN_EEE)* 82(SDA)*; U18 1(OVCUR)* 2(NC)* 5(DM4)* 6(DP4)* 13(LED3/SCL)* 17(NC)* 18(PSELF)* 22(LED1)* 23(LED2)* 24(PWREN)*

### Layout directives
differential pair: P1_MDI_A_N, P1_MDI_A_P, P1_MDI_B_N, P1_MDI_B_P, P1_MDI_C_N, P1_MDI_C_P, P1_MDI_D_N, P1_MDI_D_P, P1_MDIO_A_N, P1_MDIO_A_P, P1_MDIO_B_N, P1_MDIO_B_P, P1_MDIO_C_N, P1_MDIO_C_P, P1_MDIO_D_N, P1_MDIO_D_P, P2_MDI_A_N, P2_MDI_A_P, P2_MDI_B_N, P2_MDI_B_P, P2_MDI_C_N, P2_MDI_C_P, P2_MDI_D_N, P2_MDI_D_P, P2_MDIO_A_N, P2_MDIO_A_P, P2_MDIO_B_N, P2_MDIO_B_P, P2_MDIO_C_N, P2_MDIO_C_P, P2_MDIO_D_N, P2_MDIO_D_P, P3_MDI_A_N, P3_MDI_A_P, P3_MDI_B_N, P3_MDI_B_P, P3_MDIO_A_N, P3_MDIO_A_P, P3_MDIO_B_N, P3_MDIO_B_P, P4_MDI_A_N, P4_MDI_A_P, P4_MDI_B_N, P4_MDI_B_P, P4_MDIO_A_N, P4_MDIO_A_P, P4_MDIO_B_N, P4_MDIO_B_P, USB_N, USB_P
net class SW_EPHY_P2: P2_MDI_A_N, P2_MDI_A_P, P2_MDI_B_N, P2_MDI_B_P, P2_MDI_C_N, P2_MDI_C_P, P2_MDI_D_N, P2_MDI_D_P
net class SW_EPHY_P4: P4_MDI_A_N, P4_MDI_A_P, P4_MDI_B_N, P4_MDI_B_P
net class SW_EPHY_P0: RV1103_ETH_RX_N, RV1103_ETH_RX_P, RV1103_ETH_TX_N, RV1103_ETH_TX_P
net class SW_EPHY_P1: P1_MDI_A_N, P1_MDI_A_P, P1_MDI_B_N, P1_MDI_B_P, P1_MDI_C_N, P1_MDI_C_P, P1_MDI_D_N, P1_MDI_D_P
net class SW_EPHY_P3: P3_MDI_A_N, P3_MDI_A_P, P3_MDI_B_N, P3_MDI_B_P

### Notes on the sheet
- AVDDH
- AVDDL
- DVDDIO
- DVDDL
- 1V1_PLL
- (in symbol RTL8367N-VB-CG, part A) 1 of 2
- (in symbol RTL8367N-VB-CG, part B) 2 of 2

### Library data of the parts
B4 = Bottom-2P-1Way: as B1 on sheet RV1103; Device: TS342A2P-WZ; LCSC Part Name: 轻触开关 3*4*2 两脚小龟不带柱 250gf 黑色塑胶按钮; Supplier Part: C557591; Manufacturer Part: TS342A2P-WZ; Supplier Footprint: SMD; JLCPCB Part Class: Extended Part; Datasheet: https://atta.szlcsc.com/upload/public/pdf/source/20200519/C557591_B3A5A21584733303F06306F18577DA8B.pdf; Supplier: LCSC; Convert to PCB: yes
C139-C181 = SMT_Cap: 贴片电容; ComponentLink1Description: 供应商链接; ComponentLink1URL: http://www.szlcsc.com/product/details_29010.html; Package: 0805; Supplier: LC; SuppliersPartNumber: C28260
D1-D6 = LED: 发光二极管; ComponentLink1Description: 供应商链接; ComponentLink1URL: http://www.szlcsc.com/product/details_2663.html; Package: 0603; Supplier: LC; SuppliersPartNumber: C2290
J4 J5 = Oscillator_SMT_4P
JP10 JP11 = Header 8: 8P接插件; 卖家免费技术支持，联系售后: 唯一出售店铺网址https://shop463601444.taobao.com; 封装库来自淘宝卖家 ID：黄晶宝石: 其他店铺购入均为假冒，请申请退款，本店现金奖励; 优秀评价可免费更新封装库: 联系淘宝ID：黄晶宝石，获取更新版封装库; BOM名称: 8P接插件
P7 P8 = Header 4: as JP1 on sheet RV1103; BOM名称: 4P接插件
R32-R35 R38 R39 R47 R53 R60 R96-R98 R100-R102 R104-R124 = SMT_Res: 贴片电阻; ComponentLink1Description: 供应商链接; ComponentLink1URL: http://www.szlcsc.com/product/details_23980.html; Package: 0603; Supplier: LC; SuppliersPartNumber: C23253
U17 = RTL8367N-VB-CG: SINGLE-CHIP 5-PORT 10/100/1000M / SWITCH CONTROLLER; Mfr_Name: Realtek; Copyright: Copyright (C) 2023 Ultra Librarian. All rights reserved.; Manufacturer_Part_Number: RTL8367N-VB-CG; RefDes: RefDes; Type: DEV
U18 = CH334F: USB hub controller
U19-U21 = GST5009-LF: Network